# EAGLE schematic DSPBoard (EAGLE 9.2.2)

## Sheet 1 of 9: Power Supply
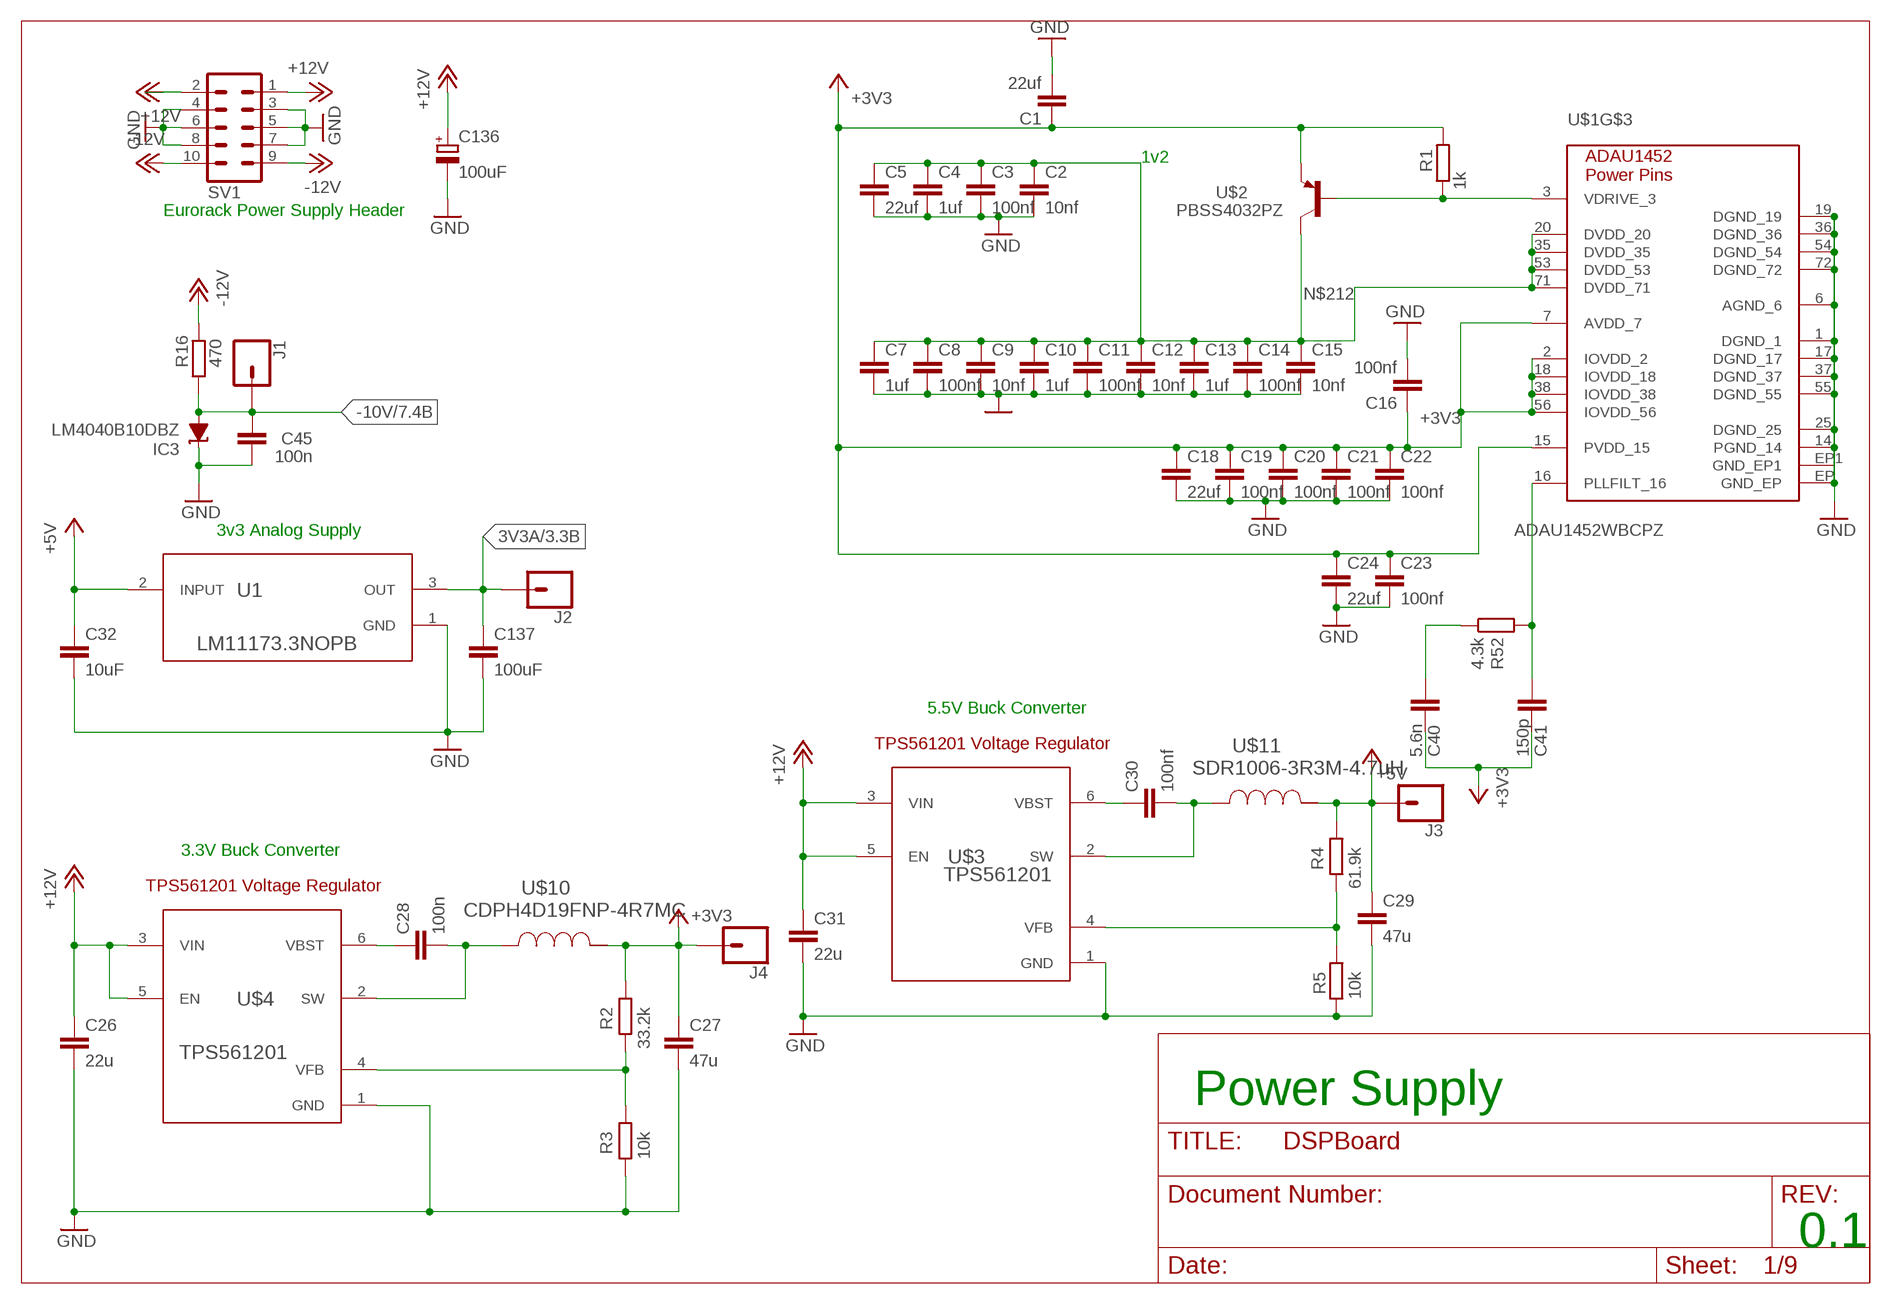
[diagram p0: schematic, sheet 1]

### Parts
C1  22uf  C-EUC0603  [C0603]
C2  10nf  C-EUC0603  [C0603]
C3  100nf  C-EUC0603  [C0603]
C4  1uf  C-EUC0603  [C0603]
C5  22uf  C-EUC0603  [C0603]
C7  1uf  C-EUC0603  [C0603]
C8  100nf  C-EUC0603  [C0603]
C9  10nf  C-EUC0603  [C0603]
C10  1uf  C-EUC0603  [C0603]
C11  100nf  C-EUC0603  [C0603]
C12  10nf  C-EUC0603  [C0603]
C13  1uf  C-EUC0603  [C0603]
C14  100nf  C-EUC0603  [C0603]
C15  10nf  C-EUC0603  [C0603]
C16  100nf  C-EUC0603  [C0603]
C18  22uf  C-EUC0603  [C0603]
C19  100nf  C-EUC0603  [C0603]
C20  100nf  C-EUC0603  [C0603]
C21  100nf  C-EUC0603  [C0603]
C22  100nf  C-EUC0603  [C0603]
C23  100nf  C-EUC0603  [C0603]
C24  22uf  C-EUC0603  [C0603]
C26  22u  C-EUC0603  [C0603]
C27  47u  C-EUC0603  [C0603]
C28  100n  C-EUC0603  [C0603]
C29  47u  C-EUC0603  [C0603]
C30  100nf  C-EUC0603  [C0603]
C31  22u  C-EUC0603  [C0603]
C32  10uF  C-EUC0603  [C0603]
C40  5.6n  C-EUC0603  [C0603]
C41  150p  C-EUC0603  [C0603]
C45  100n  C-EUC0603  [C0603]
C136  100uF  CPOL-EUD  [PANASONIC_D]
C137  100uF  C-EUC0603  [C0603]
IC3  LM4040B10DBZ  LM4041B12DBZ  [DBZ_R-PDSO-G3]
J1  CONN_01  [1X01]
J2  CONN_01  [1X01]
J3  CONN_01  [1X01]
J4  CONN_01  [1X01]
R1  1k  R-EU_R0603  [R0603]
R2  33.2k  R-EU_R0603  [R0603]
R3  10k  R-EU_R0603  [R0603]
R4  61.9k  R-EU_R0603  [R0603]
R5  10k  R-EU_R0603  [R0603]
R16  470  R-EU_R0603  [R0603]
R52  4.3k  R-EU_R0603  [R0603]
SV1  MA05-2  [MA05-2]
U1  LM11173.3NOPB  LM1117DTX-3.3/NOPB  [NDP0003B]
U$1  ADAU1452WBCPZ  [72-LEADLFCSP_VQ]
U$2  PBSS4032PZ  [PG-SOT-223]
U$3  TPS561201  [DDC0006A]
U$4  TPS561201  [DDC0006A]
U$10  CDPH4D19FNP-4R7MC  [CDPH4D19F]
U$11  SDR1006-3R3M-4.7uH  SDR1006-3R3ML  [SDR1006]

### Nets
3V3A: C137.1 J2.1 U1.3(OUT) ; also sheet 3,4
+3V3: C1.1 C16.1 C18.1 C19.1 C20.1 C21.1 C22.1 C23.1 C24.1 C27.1 C40.2 C41.2 J4.1 R1.2 R2.1 U$1.2(IOVDD_2) U$1.7(AVDD_7) U$1.15(PVDD_15) U$1.18(IOVDD_18) U$1.38(IOVDD_38) U$1.56(IOVDD_56) U$2.3(EMITTER_3) U$10.2 ; also sheet 2,3,8,9
+5V: C29.1 C32.1 J3.1 R4.1 U1.2(INPUT) U$11.2 ; also sheet 8,9
+12V: C26.1 C31.1 C136.+ SV1.1 SV1.2 U$3.3(VIN) U$3.5(EN) U$4.3(VIN) U$4.5(EN) ; also sheet 4,5,6,7
-10V: C45.2 IC3.2(A) J1.1 R16.1 ; also sheet 7
-12V: R16.2 SV1.9 SV1.10 ; also sheet 4,5,6,7
GND: C1.2 C2.2 C3.2 C4.2 C5.2 C7.2 C8.2 C9.2 C10.2 C11.2 C12.2 C13.2 C14.2 C15.2 C16.2 C18.2 C19.2 C20.2 C21.2 C22.2 C23.2 C24.2 C26.2 C27.2 C29.2 C31.2 C32.2 C45.1 C136.- C137.2 IC3.1(C) R3.2 R5.2 SV1.3 SV1.4 SV1.5 SV1.6 SV1.7 SV1.8 U1.1(GND) U$1.1(DGND_1) U$1.6(AGND_6) U$1.14(PGND_14) U$1.17(DGND_17) U$1.19(DGND_19) U$1.25(DGND_25) U$1.36(DGND_36) U$1.37(DGND_37) U$1.54(DGND_54) U$1.55(DGND_55) U$1.72(DGND_72) U$1.EP1(GND_EP1) U$1.EP(GND_EP) U$3.1(GND) U$4.1(GND) ; also sheet 2,3,4,5,6,7,8,9
N$1: R1.1 U$1.3(VDRIVE_3) U$2.1(BASE_1)
N$2: C30.1 U$3.6(VBST)
N$3: C28.1 U$4.6(VBST)
N$4: C28.2 U$4.2(SW) U$10.1
N$5: C30.2 U$3.2(SW) U$11.1
N$6: R2.2 R3.1 U$4.4(VFB)
N$8: R4.2 R5.1 U$3.4(VFB)
N$21: C41.1 R52.2 U$1.16(PLLFILT_16)
N$24: C40.1 R52.1
N$212: C2.1 C3.1 C4.1 C5.1 C7.1 C8.1 C9.1 C10.1 C11.1 C12.1 C13.1 C14.1 C15.1 U$1.20(DVDD_20) U$1.35(DVDD_35) U$1.53(DVDD_53) U$1.71(DVDD_71) U$2.2(COLLECTOR_2,4) U$2.4(COLLECTOR_2,4)

### Notes on the sheet
- 1v2
- Eurorack Power Supply Header
- 3v3 Analog Supply
- 5.5V Buck Converter
- 3.3V Buck Converter
- Power Supply
- 0.1

## Sheet 2 of 9: Controller, I2C & GPIO
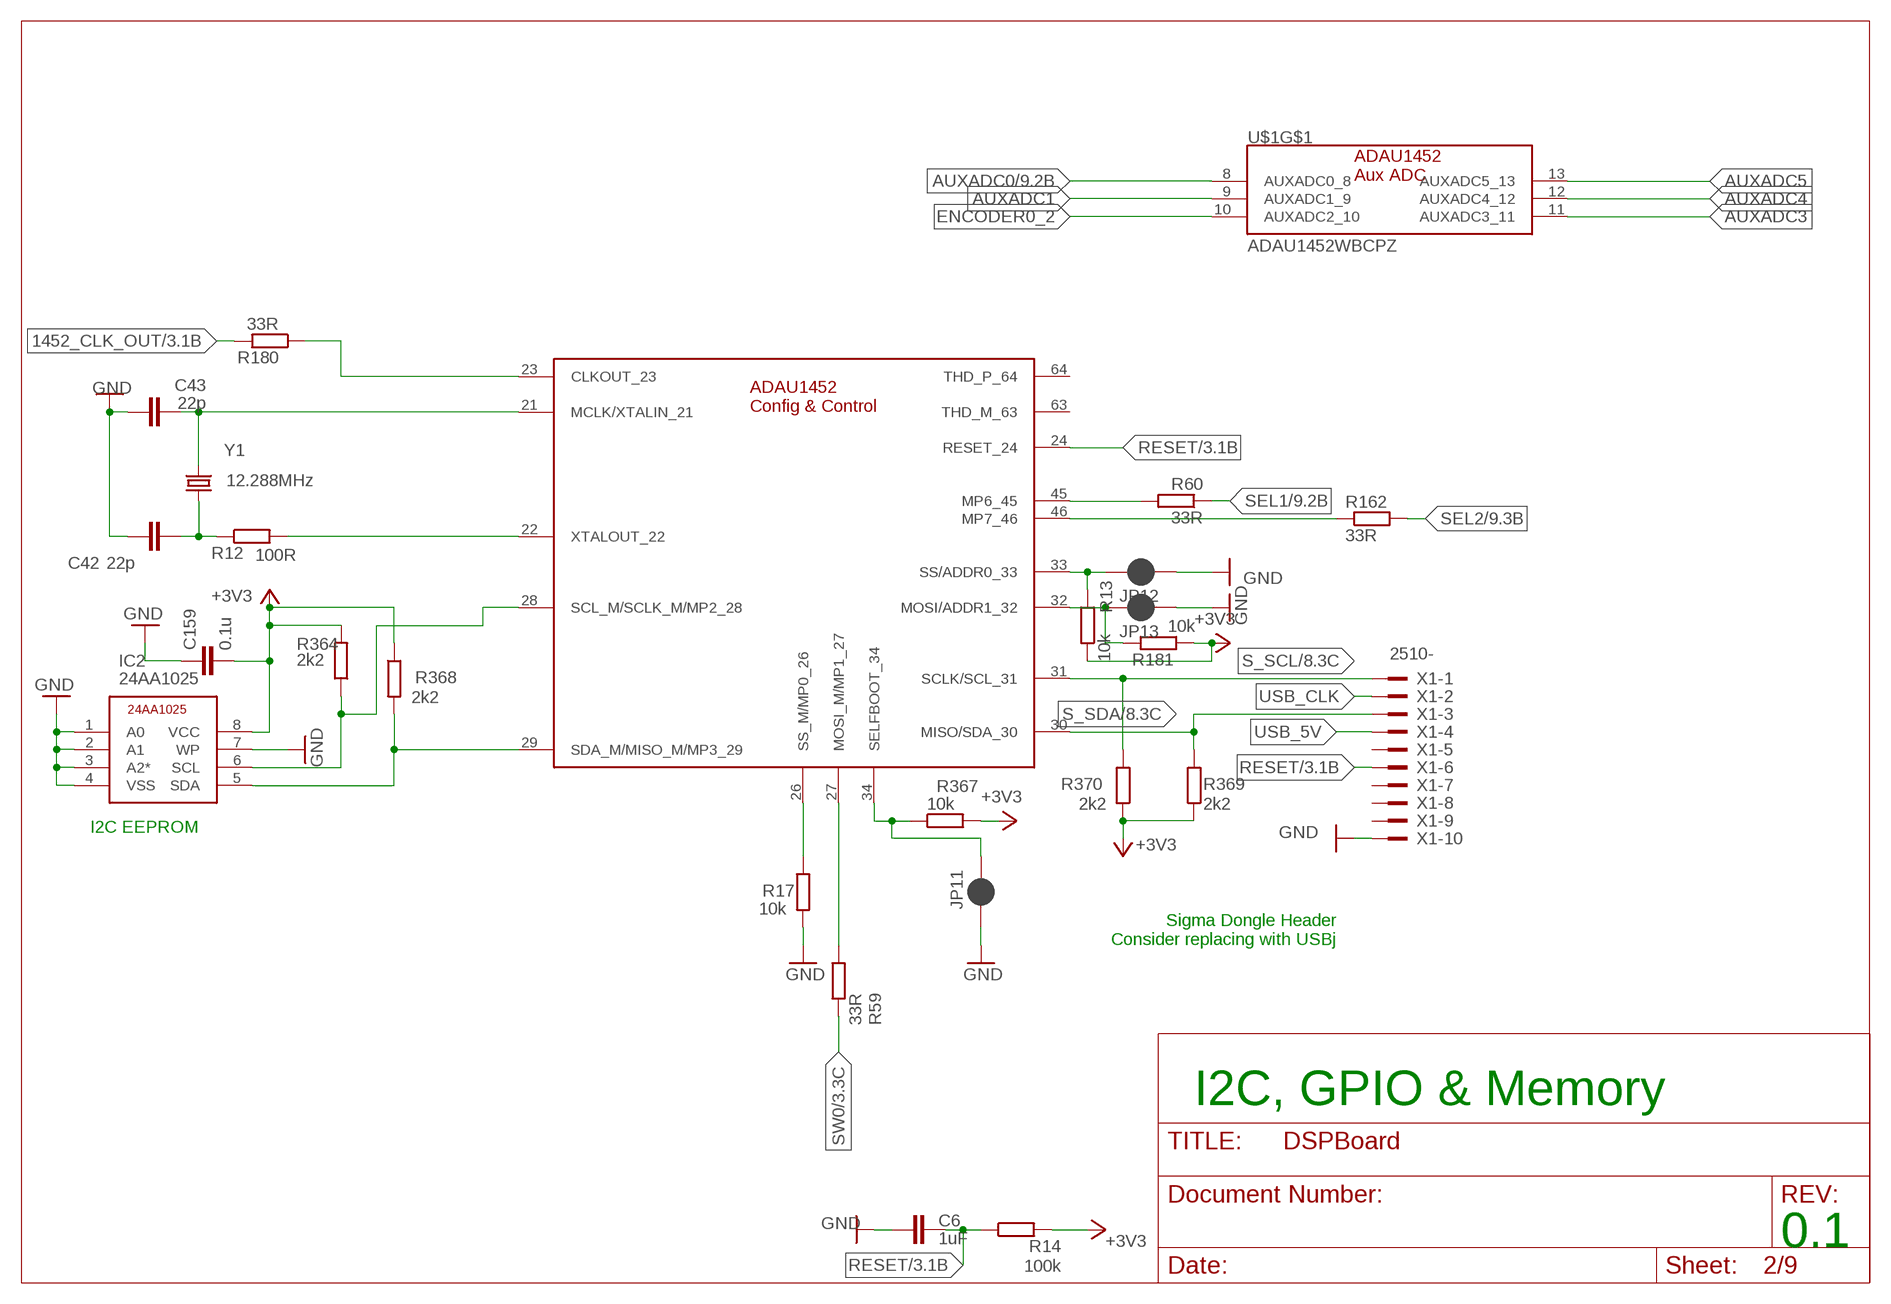
[diagram p1: schematic, sheet 2]

### Parts
C6  1uF  C-EUC0603  [C0603]
C42  22p  C-EUC0603  [C0603]
C43  22p  C-EUC0603  [C0603]
C159  0.1u  C-EUC0603  [C0603]
IC2  24AA1025  [SOIC8]
JP11  JUMPER-SMT_2_NC_PASTE_SILK  [SMT-JUMPER_2_NC_PASTE_SILK]
JP12  JUMPER-SMT_2_NC_PASTE_SILK  [SMT-JUMPER_2_NC_PASTE_SILK]
JP13  JUMPER-SMT_2_NC_PASTE_SILK  [SMT-JUMPER_2_NC_PASTE_SILK]
R12  100R  R-EU_R0603  [R0603]
R13  10k  R-EU_R0603  [R0603]
R14  100k  R-EU_R0603  [R0603]
R17  10k  R-EU_R0603  [R0603]
R59  33R  R-EU_R0603  [R0603]
R60  33R  R-EU_R0603  [R0603]
R162  33R  R-EU_R0603  [R0603]
R180  33R  R-EU_R0603  [R0603]
R181  10k  R-EU_R0603  [R0603]
R364  2k2  R-EU_R0603  [R0603]
R367  10k  R-EU_R0603  [R0603]
R368  2k2  R-EU_R0603  [R0603]
R369  2k2  R-EU_R0603  [R0603]
R370  2k2  R-EU_R0603  [R0603]
X1  2510-  [PAK100/2500-10]
Y1  12.288MHz  CRYSTAL-12.288MHZ"  [CRYSTAL-SMD-5X3.2-4PAD]

### Nets
1452_CLK_OUT: R180.2 ; also sheet 3
+3V3: C159.2 IC2.8(VCC) R13.1 R14.2 R181.1 R364.2 R367.2 R368.1 R369.1 R370.1 ; also sheet 1,3,8,9
AUXADC0: U$1.8(AUXADC0_8) ; also sheet 9
AUXADC1: U$1.9(AUXADC1_9)
AUXADC3: U$1.11(AUXADC3_11)
AUXADC4: U$1.12(AUXADC4_12)
AUXADC5: U$1.13(AUXADC5_13)
ENCODER0_2: U$1.10(AUXADC2_10)
GND: C6.2 C42.1 C43.1 C159.1 IC2.1(A0) IC2.2(A1) IC2.3(A2*) IC2.4(VSS) IC2.7(WP) JP11.1 JP12.1 JP13.1 R17.2 X1.10 ; also sheet 1,3,4,5,6,7,8,9
MP0: R17.1 U$1.26(SS_M/MP0_26)
MP1: R59.1 U$1.27(MOSI_M/MP1_27)
MP2: IC2.6(SCL) R364.1 U$1.28(SCL_M/SCLK_M/MP2_28)
MP3: IC2.5(SDA) R368.2 U$1.29(SDA_M/MISO_M/MP3_29)
MP6: R60.2 U$1.45(MP6_45)
MP7: R162.1 U$1.46(MP7_46)
N$27: R12.2 U$1.22(XTALOUT_22)
N$28: C43.2 U$1.21(MCLK/XTALIN_21) Y1.3
N$29: C42.2 R12.1 Y1.1
N$141: R180.1 U$1.23(CLKOUT_23)
N$142: JP12.2 R13.2 U$1.33(SS/ADDR0_33)
N$157: JP13.2 R181.2 U$1.32(MOSI/ADDR1_32)
N$545: JP11.2 R367.1 U$1.34(SELFBOOT_34)
RESET: C6.1 R14.1 U$1.24(RESET_24) X1.6 ; also sheet 3,8
S_SCL: R370.2 U$1.31(SCLK/SCL_31) X1.1 ; also sheet 8
S_SDA: R369.2 U$1.30(MISO/SDA_30) X1.3 ; also sheet 8
SEL1: R60.1 ; also sheet 9
SEL2: R162.2 ; also sheet 9
SW0: R59.2 ; also sheet 3,9
USB_5V: X1.4
USB_CLK: X1.2
Unconnected: U$1.63(THD_M_63) U$1.64(THD_P_64) X1.5 X1.7 X1.8 X1.9

### Notes on the sheet
- I2C EEPROM
- Sigma Dongle Header
  Consider replacing with USBj
- I2C, GPIO & Memory
- 0.1

## Sheet 3 of 9: Digital Audio Connections
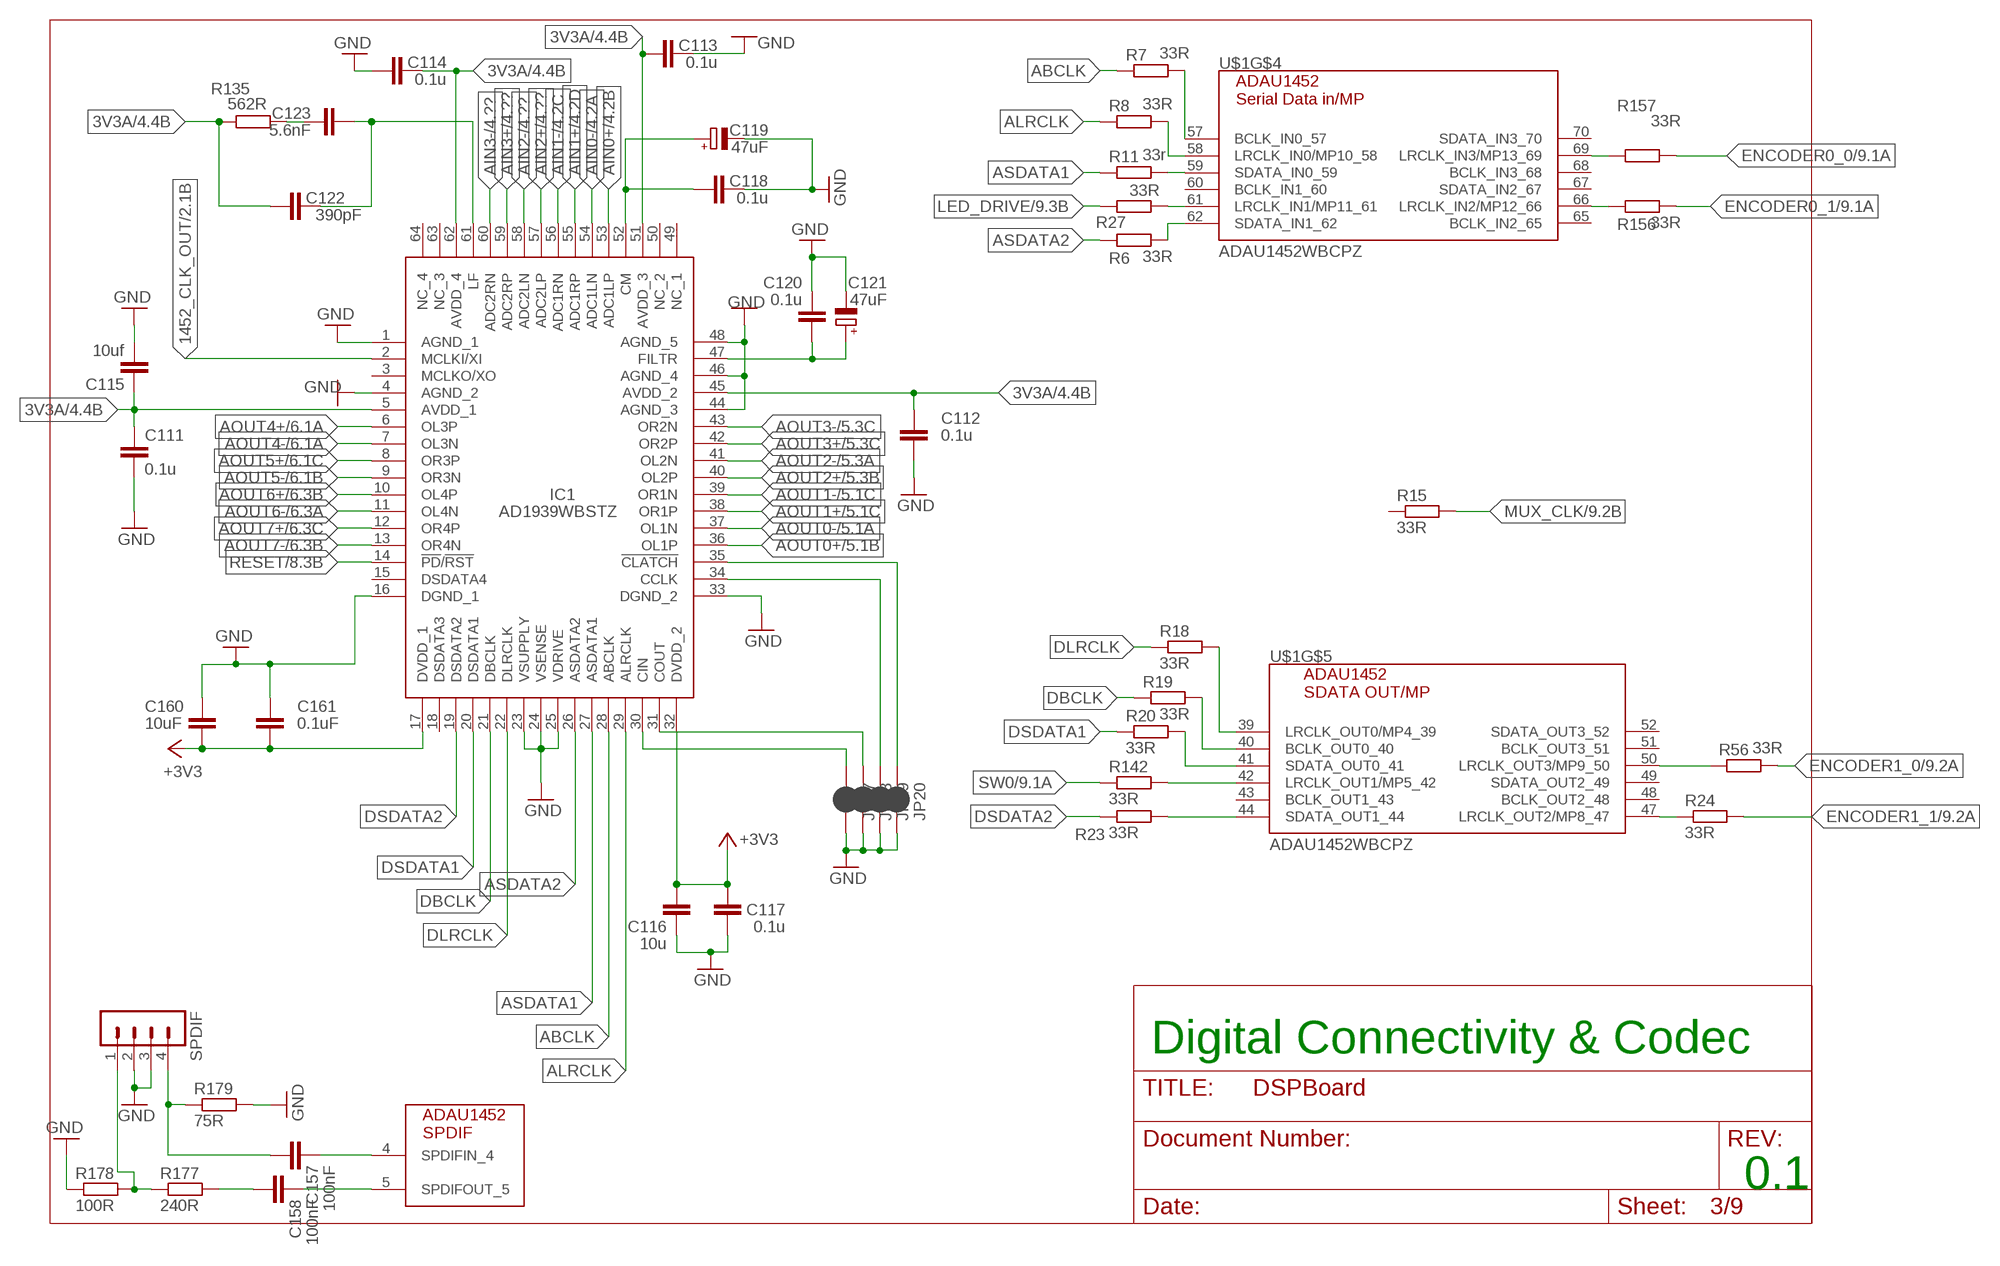
[diagram p2: schematic, sheet 3]

### Parts
C111  0.1u  C-EUC0603  [C0603]
C112  0.1u  C-EUC0603  [C0603]
C113  0.1u  C-EUC0603  [C0603]
C114  0.1u  C-EUC0603  [C0603]
C115  10uf  C-EUC0603  [C0603]
C116  10u  C-EUC0603  [C0603]
C117  0.1u  C-EUC0603  [C0603]
C118  0.1u  C-EUC0603  [C0603]
C119  47uF  CPOL-EUD  [PANASONIC_D]
C120  0.1u  C-EUC0603  [C0603]
C121  47uF  CPOL-EUD  [PANASONIC_D]
C122  390pF  C-EUC0603  [C0603]
C123  5.6nF  C-EUC0603  [C0603]
C157  100nF  C-EUC0603  [C0603]
C158  100nF  C-EUC0603  [C0603]
C160  10uF  C-EUC0603  [C0603]
C161  0.1uF  C-EUC0603  [C0603]
IC1  AD1939WBSTZ  [QFP50P1200X1200X160-64N]
JP17  JUMPER-SMT_2_NC_PASTE_SILK  [SMT-JUMPER_2_NC_PASTE_SILK]
JP18  JUMPER-SMT_2_NC_PASTE_SILK  [SMT-JUMPER_2_NC_PASTE_SILK]
JP19  JUMPER-SMT_2_NC_PASTE_SILK  [SMT-JUMPER_2_NC_PASTE_SILK]
JP20  JUMPER-SMT_2_NC_PASTE_SILK  [SMT-JUMPER_2_NC_PASTE_SILK]
R6  33R  R-EU_R0603  [R0603]
R7  33R  R-EU_R0603  [R0603]
R8  33R  R-EU_R0603  [R0603]
R11  33r  R-EU_R0603  [R0603]
R15  33R  R-EU_R0603  [R0603]
R18  33R  R-EU_R0603  [R0603]
R19  33R  R-EU_R0603  [R0603]
R20  33R  R-EU_R0603  [R0603]
R23  33R  R-EU_R0603  [R0603]
R24  33R  R-EU_R0603  [R0603]
R27  33R  R-EU_R0603  [R0603]
R56  33R  R-EU_R0603  [R0603]
R135  562R  R-EU_R0603  [R0603]
R142  33R  R-EU_R0603  [R0603]
R156  33R  R-EU_R0603  [R0603]
R157  33R  R-EU_R0603  [R0603]
R177  240R  R-EU_R0603  [R0603]
R178  100R  R-EU_R0603  [R0603]
R179  75R  R-EU_R0603  [R0603]
SPDIF  MA04-1  [MA04-1]

### Nets
3V3A: C111.1 C112.1 C113.1 C114.2 C115.1 C122.1 IC1.5(AVDD_1) IC1.45(AVDD_2) IC1.51(AVDD_3) IC1.62(AVDD_4) R135.1 ; also sheet 1,4
1452_CLK_OUT: IC1.2(MCLKI/XI) ; also sheet 2
+3V3: C116.2 C117.2 C160.2 C161.2 IC1.17(DVDD_1) IC1.32(DVDD_2) ; also sheet 1,2,8,9
ABCLK: IC1.28(ABCLK) R7.1
AIN0+: IC1.53(ADC1LP) ; also sheet 4
AIN0-: IC1.54(ADC1LN) ; also sheet 4
AIN1+: IC1.55(ADC1RP) ; also sheet 4
AIN1-: IC1.56(ADC1RN) ; also sheet 4
AIN2+: IC1.57(ADC2LP) ; also sheet 4
AIN2-: IC1.58(ADC2LN) ; also sheet 4
AIN3+: IC1.59(ADC2RP) ; also sheet 4
AIN3-: IC1.60(ADC2RN) ; also sheet 4
ALRCLK: IC1.29(ALRCLK) R8.1
AOUT0+: IC1.36(OL1P) ; also sheet 5
AOUT0-: IC1.37(OL1N) ; also sheet 5
AOUT1+: IC1.38(OR1P) ; also sheet 5
AOUT1-: IC1.39(OR1N) ; also sheet 5
AOUT2+: IC1.40(OL2P) ; also sheet 5
AOUT2-: IC1.41(OL2N) ; also sheet 5
AOUT3+: IC1.42(OR2P) ; also sheet 5
AOUT3-: IC1.43(OR2N) ; also sheet 5
AOUT4+: IC1.6(OL3P) ; also sheet 6
AOUT4-: IC1.7(OL3N) ; also sheet 6
AOUT5+: IC1.8(OR3P) ; also sheet 6
AOUT5-: IC1.9(OR3N) ; also sheet 6
AOUT6+: IC1.10(OL4P) ; also sheet 6
AOUT6-: IC1.11(OL4N) ; also sheet 6
AOUT7+: IC1.12(OR4P) ; also sheet 6
AOUT7-: IC1.13(OR4N) ; also sheet 6
ASDATA1: IC1.27(ASDATA1) R11.1
ASDATA2: IC1.26(ASDATA2) R6.1
DBCLK: IC1.21(DBCLK) R19.1
DLRCLK: IC1.22(DLRCLK) R18.1
DSDATA1: IC1.20(DSDATA1) R20.1
DSDATA2: IC1.19(DSDATA2) R23.1
DSP_47: R24.1 U$1.47(LRCLK_OUT2/MP8_47)
DSP_50: R56.1 U$1.50(LRCLK_OUT3/MP9_50)
ENCODER0_0: R157.2 ; also sheet 9
ENCODER0_1: R156.2 ; also sheet 9
ENCODER1_0: R56.2 ; also sheet 9
ENCODER1_1: R24.2 ; also sheet 9
FILTR: C120.1 C121.+ IC1.47(FILTR)
GND: C111.2 C112.2 C113.2 C114.1 C115.2 C116.1 C117.1 C118.2 C119.- C120.2 C121.- C160.1 C161.1 IC1.1(AGND_1) IC1.4(AGND_2) IC1.16(DGND_1) IC1.23(VSUPPLY) IC1.24(VSENSE) IC1.25(VDRIVE) IC1.33(DGND_2) IC1.44(AGND_3) IC1.46(AGND_4) IC1.48(AGND_5) JP17.2 JP18.2 JP19.2 JP20.2 R178.1 R179.2 SPDIF.2 SPDIF.3 ; also sheet 1,2,4,5,6,7,8,9
LED_DRIVE: R27.2 ; also sheet 9
MP4: R18.2 U$1.39(LRCLK_OUT0/MP4_39)
MP5: R142.2 U$1.42(LRCLK_OUT1/MP5_42)
MP10: R8.2 U$1.58(LRCLK_IN0/MP10_58)
MP11: R27.1 U$1.61(LRCLK_IN1/MP11_61)
MUX_CLK: R15.2 ; also sheet 9
N$7: IC1.30(CIN) JP17.1
N$19: R156.1 U$1.66(LRCLK_IN2/MP12_66)
N$20: R157.1 U$1.69(LRCLK_IN3/MP13_69)
N$23: JP20.1
N$25: JP19.1
N$31: C157.1 U$1.4(SPDIFIN_4)
N$32: C158.1 U$1.5(SPDIFOUT_5)
N$35: R6.2 U$1.62(SDATA_IN1_62)
N$37: C157.2 R179.1 SPDIF.4
N$75: C118.1 C119.+ IC1.52(CM)
N$76: R7.2 U$1.57(BCLK_IN0_57)
N$117: C123.1 R135.2
N$119: C122.2 C123.2 IC1.61(LF)
N$120: R11.2 U$1.59(SDATA_IN0_59)
N$124: R23.2 U$1.44(SDATA_OUT1_44)
N$127: R20.2 U$1.41(SDATA_OUT0_41)
N$128: R19.2 U$1.40(BCLK_OUT0_40)
N$129: C158.2 R177.2
N$135: IC1.35(!CLATCH)
N$138: R177.1 R178.2 SPDIF.1
N$158: IC1.34(CCLK)
N$159: IC1.31(COUT) JP18.1
RESET: IC1.14(!PD!/!RST) ; also sheet 2,8
SW0: R142.1 ; also sheet 2,9
Unconnected: IC1.3(MCLKO/XO) IC1.15(DSDATA4) IC1.18(DSDATA3) IC1.49(NC_1) IC1.50(NC_2) IC1.63(NC_3) IC1.64(NC_4) R15.1 U$1.43(BCLK_OUT1_43) U$1.48(BCLK_OUT2_48) U$1.49(SDATA_OUT2_49) U$1.51(BCLK_OUT3_51) U$1.52(SDATA_OUT3_52) U$1.60(BCLK_IN1_60) U$1.65(BCLK_IN2_65) U$1.67(SDATA_IN2_67) U$1.68(BCLK_IN3_68) U$1.70(SDATA_IN3_70)

### Notes on the sheet
- Digital Connectivity & Codec
- 0.1

## Sheet 4 of 9: Audio In
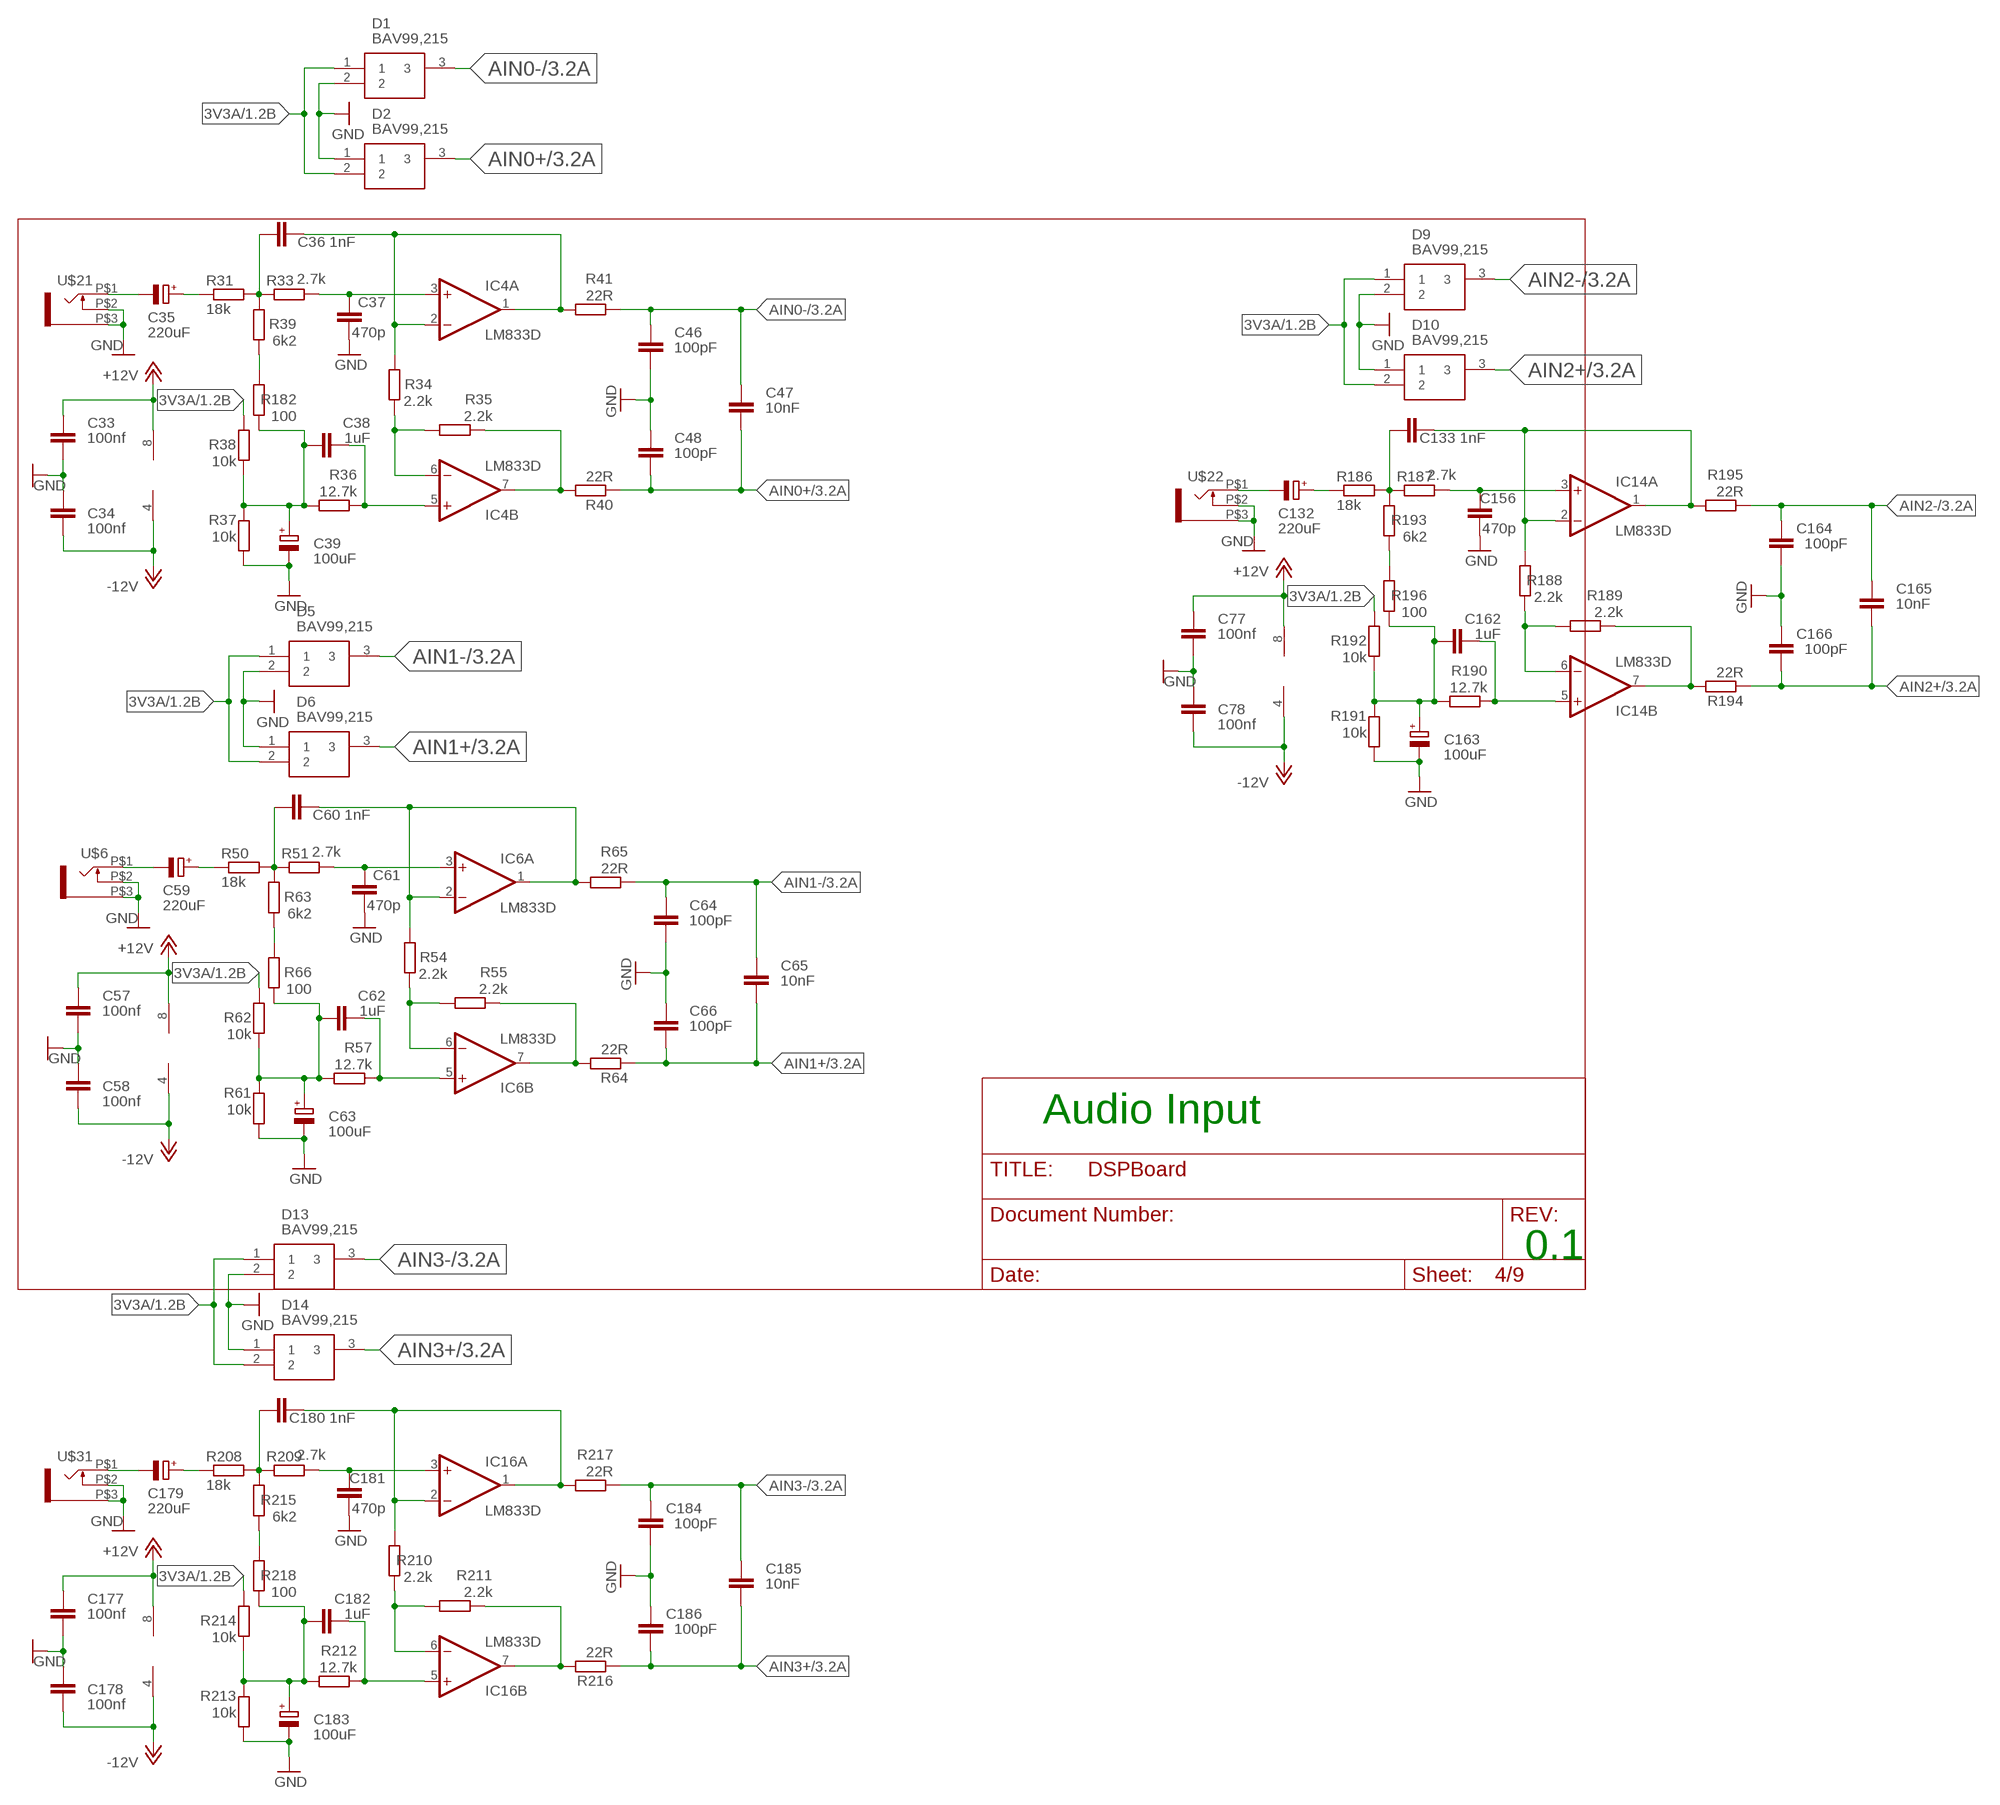
[diagram p3: schematic, sheet 4]

### Parts
C33  100nf  C-EUC0603  [C0603]
C34  100nf  C-EUC0603  [C0603]
C35  220uF  CPOL-EUD  [PANASONIC_D]
C36  1nF  C-EUC0603  [C0603]
C37  470p  C-EUC0603  [C0603]
C38  1uF  C-EUC0603  [C0603]
C39  100uF  CPOL-EUD  [PANASONIC_D]
C46  100pF  C-EUC0603  [C0603]
C47  10nF  C-EUC0603  [C0603]
C48  100pF  C-EUC0603  [C0603]
C57  100nf  C-EUC0603  [C0603]
C58  100nf  C-EUC0603  [C0603]
C59  220uF  CPOL-EUD  [PANASONIC_D]
C60  1nF  C-EUC0603  [C0603]
C61  470p  C-EUC0603  [C0603]
C62  1uF  C-EUC0603  [C0603]
C63  100uF  CPOL-EUD  [PANASONIC_D]
C64  100pF  C-EUC0603  [C0603]
C65  10nF  C-EUC0603  [C0603]
C66  100pF  C-EUC0603  [C0603]
C77  100nf  C-EUC0603  [C0603]
C78  100nf  C-EUC0603  [C0603]
C132  220uF  CPOL-EUD  [PANASONIC_D]
C133  1nF  C-EUC0603  [C0603]
C156  470p  C-EUC0603  [C0603]
C162  1uF  C-EUC0603  [C0603]
C163  100uF  CPOL-EUD  [PANASONIC_D]
C164  100pF  C-EUC0603  [C0603]
C165  10nF  C-EUC0603  [C0603]
C166  100pF  C-EUC0603  [C0603]
C177  100nf  C-EUC0603  [C0603]
C178  100nf  C-EUC0603  [C0603]
C179  220uF  CPOL-EUD  [PANASONIC_D]
C180  1nF  C-EUC0603  [C0603]
C181  470p  C-EUC0603  [C0603]
C182  1uF  C-EUC0603  [C0603]
C183  100uF  CPOL-EUD  [PANASONIC_D]
C184  100pF  C-EUC0603  [C0603]
C185  10nF  C-EUC0603  [C0603]
C186  100pF  C-EUC0603  [C0603]
D1  BAV99,215  [SOT95P230X110-3N]
D2  BAV99,215  [SOT95P230X110-3N]
D5  BAV99,215  [SOT95P230X110-3N]
D6  BAV99,215  [SOT95P230X110-3N]
D9  BAV99,215  [SOT95P230X110-3N]
D10  BAV99,215  [SOT95P230X110-3N]
D13  BAV99,215  [SOT95P230X110-3N]
D14  BAV99,215  [SOT95P230X110-3N]
IC4  LM833D  [SO08]
IC6  LM833D  [SO08]
IC14  LM833D  [SO08]
IC16  LM833D  [SO08]
R31  18k  R-EU_R0603  [R0603]
R33  2.7k  R-EU_R0603  [R0603]
R34  2.2k  R-EU_R0603  [R0603]
R35  2.2k  R-EU_R0603  [R0603]
R36  12.7k  R-EU_R0603  [R0603]
R37  10k  R-EU_R0603  [R0603]
R38  10k  R-EU_R0603  [R0603]
R39  6k2  R-EU_R0603  [R0603]
R40  22R  R-EU_R0603  [R0603]
R41  22R  R-EU_R0603  [R0603]
R50  18k  R-EU_R0603  [R0603]
R51  2.7k  R-EU_R0603  [R0603]
R54  2.2k  R-EU_R0603  [R0603]
R55  2.2k  R-EU_R0603  [R0603]
R57  12.7k  R-EU_R0603  [R0603]
R61  10k  R-EU_R0603  [R0603]
R62  10k  R-EU_R0603  [R0603]
R63  6k2  R-EU_R0603  [R0603]
R64  22R  R-EU_R0603  [R0603]
R65  22R  R-EU_R0603  [R0603]
R66  100  R-EU_R0603  [R0603]
R182  100  R-EU_R0603  [R0603]
R186  18k  R-EU_R0603  [R0603]
R187  2.7k  R-EU_R0603  [R0603]
R188  2.2k  R-EU_R0603  [R0603]
R189  2.2k  R-EU_R0603  [R0603]
R190  12.7k  R-EU_R0603  [R0603]
R191  10k  R-EU_R0603  [R0603]
R192  10k  R-EU_R0603  [R0603]
R193  6k2  R-EU_R0603  [R0603]
R194  22R  R-EU_R0603  [R0603]
R195  22R  R-EU_R0603  [R0603]
R196  100  R-EU_R0603  [R0603]
R208  18k  R-EU_R0603  [R0603]
R209  2.7k  R-EU_R0603  [R0603]
R210  2.2k  R-EU_R0603  [R0603]
R211  2.2k  R-EU_R0603  [R0603]
R212  12.7k  R-EU_R0603  [R0603]
R213  10k  R-EU_R0603  [R0603]
R214  10k  R-EU_R0603  [R0603]
R215  6k2  R-EU_R0603  [R0603]
R216  22R  R-EU_R0603  [R0603]
R217  22R  R-EU_R0603  [R0603]
R218  100  R-EU_R0603  [R0603]
U$6  WQP-PJ301M-12_JACK  [WQP-PJ301M-12_JACK]
U$21  WQP-PJ301M-12_JACK  [WQP-PJ301M-12_JACK]
U$22  WQP-PJ301M-12_JACK  [WQP-PJ301M-12_JACK]
U$31  WQP-PJ301M-12_JACK  [WQP-PJ301M-12_JACK]

### Nets
3V3A: D1.1 D2.2 D5.1 D6.2 D9.1 D10.2 D13.1 D14.2 R38.2 R62.2 R192.2 R214.2 ; also sheet 1,3
+12V: C33.1 C57.1 C77.1 C177.1 IC4.8(P:V+) IC6.8(P:V+) IC14.8(P:V+) IC16.8(P:V+) ; also sheet 1,5,6,7
-12V: C34.2 C58.2 C78.2 C178.2 IC4.4(P:V-) IC6.4(P:V-) IC14.4(P:V-) IC16.4(P:V-) ; also sheet 1,5,6,7
AIN0+: C47.2 C48.1 D2.3 R40.1 ; also sheet 3
AIN0-: C46.2 C47.1 D1.3 R41.1 ; also sheet 3
AIN1+: C65.2 C66.1 D6.3 R64.1 ; also sheet 3
AIN1-: C64.2 C65.1 D5.3 R65.1 ; also sheet 3
AIN2+: C165.2 C166.1 D10.3 R194.1 ; also sheet 3
AIN2-: C164.2 C165.1 D9.3 R195.1 ; also sheet 3
AIN3+: C185.2 C186.1 D14.3 R216.1 ; also sheet 3
AIN3-: C184.2 C185.1 D13.3 R217.1 ; also sheet 3
GND: C33.2 C34.1 C37.1 C39.- C46.1 C48.2 C57.2 C58.1 C61.1 C63.- C64.1 C66.2 C77.2 C78.1 C156.1 C163.- C164.1 C166.2 C177.2 C178.1 C181.1 C183.- C184.1 C186.2 D1.2 D2.1 D5.2 D6.1 D9.2 D10.1 D13.2 D14.1 R37.1 R61.1 R191.1 R213.1 U$6.P$2 U$6.P$3 U$21.P$2 U$21.P$3 U$22.P$2 U$22.P$3 U$31.P$2 U$31.P$3 ; also sheet 1,2,3,5,6,7,8,9
N$9: C35.- U$21.P$1
N$10: C35.+ R31.1
N$11: C36.1 R31.2 R33.1 R39.2
N$12: C37.2 IC4.3(A:+IN) R33.2
N$13: IC4.6(B:-IN) R34.1 R35.2
N$14: C36.2 IC4.1(A:OUT) IC4.2(A:-IN) R34.2 R41.2
N$15: IC4.7(B:OUT) R35.1 R40.2
N$16: C38.2 IC4.5(B:+IN) R36.1
N$18: C38.1 C39.+ R36.2 R37.2 R38.1 R182.1
N$42: C60.1 R50.2 R51.1 R63.2
N$43: C61.2 IC6.3(A:+IN) R51.2
N$44: C60.2 IC6.1(A:OUT) IC6.2(A:-IN) R54.2 R65.2
N$45: IC6.6(B:-IN) R54.1 R55.2
N$46: IC6.7(B:OUT) R55.1 R64.2
N$47: C62.2 IC6.5(B:+IN) R57.1
N$48: C62.1 C63.+ R57.2 R61.2 R62.1 R66.1
N$49: C59.- U$6.P$1
N$50: C59.+ R50.1
N$51: R63.1 R66.2
N$160: R39.1 R182.2
N$168: C133.1 R186.2 R187.1 R193.2
N$169: C156.2 IC14.3(A:+IN) R187.2
N$170: C133.2 IC14.1(A:OUT) IC14.2(A:-IN) R188.2 R195.2
N$171: IC14.6(B:-IN) R188.1 R189.2
N$172: IC14.7(B:OUT) R189.1 R194.2
N$173: C162.2 IC14.5(B:+IN) R190.1
N$174: C162.1 C163.+ R190.2 R191.2 R192.1 R196.1
N$175: C132.- U$22.P$1
N$176: C132.+ R186.1
N$177: R193.1 R196.2
N$188: C180.1 R208.2 R209.1 R215.2
N$189: C181.2 IC16.3(A:+IN) R209.2
N$190: C180.2 IC16.1(A:OUT) IC16.2(A:-IN) R210.2 R217.2
N$191: IC16.6(B:-IN) R210.1 R211.2
N$192: IC16.7(B:OUT) R211.1 R216.2
N$193: C182.2 IC16.5(B:+IN) R212.1
N$194: C182.1 C183.+ R212.2 R213.2 R214.1 R218.1
N$195: C179.- U$31.P$1
N$196: C179.+ R208.1
N$197: R215.1 R218.2

### Notes on the sheet
- Audio Input
- 0.1

## Sheet 5 of 9: Audio Out 1
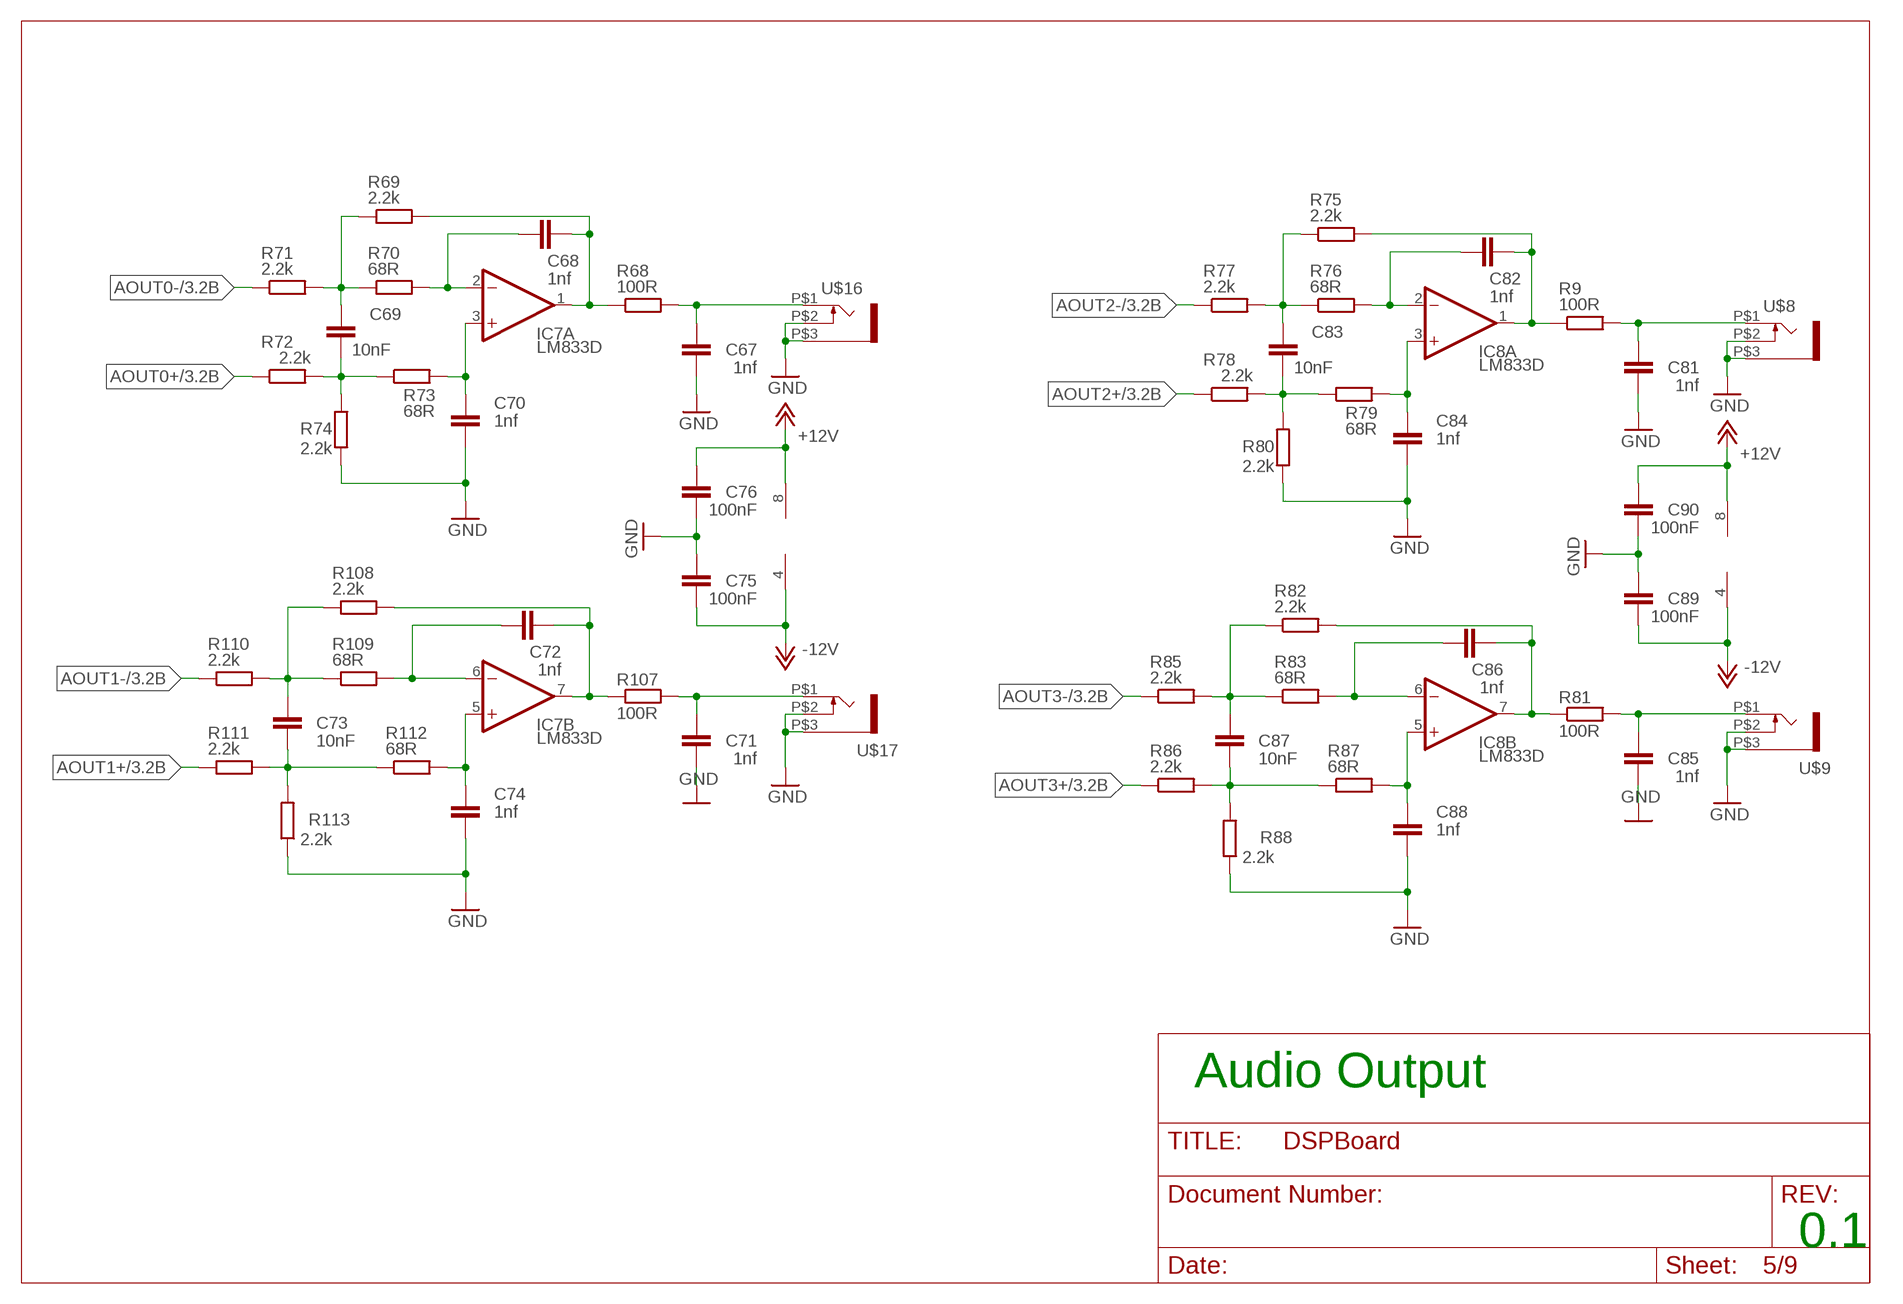
[diagram p4: schematic, sheet 5]

### Parts
C67  1nf  C-EUC0603  [C0603]
C68  1nf  C-EUC0603  [C0603]
C69  10nF  C-EUC0603  [C0603]
C70  1nf  C-EUC0603  [C0603]
C71  1nf  C-EUC0603  [C0603]
C72  1nf  C-EUC0603  [C0603]
C73  10nF  C-EUC0603  [C0603]
C74  1nf  C-EUC0603  [C0603]
C75  100nF  C-EUC0603  [C0603]
C76  100nF  C-EUC0603  [C0603]
C81  1nf  C-EUC0603  [C0603]
C82  1nf  C-EUC0603  [C0603]
C83  10nF  C-EUC0603  [C0603]
C84  1nf  C-EUC0603  [C0603]
C85  1nf  C-EUC0603  [C0603]
C86  1nf  C-EUC0603  [C0603]
C87  10nF  C-EUC0603  [C0603]
C88  1nf  C-EUC0603  [C0603]
C89  100nF  C-EUC0603  [C0603]
C90  100nF  C-EUC0603  [C0603]
IC7  LM833D  [SO08]
IC8  LM833D  [SO08]
R9  100R  R-EU_R0603  [R0603]
R68  100R  R-EU_R0603  [R0603]
R69  2.2k  R-EU_R0603  [R0603]
R70  68R  R-EU_R0603  [R0603]
R71  2.2k  R-EU_R0603  [R0603]
R72  2.2k  R-EU_R0603  [R0603]
R73  68R  R-EU_R0603  [R0603]
R74  2.2k  R-EU_R0603  [R0603]
R75  2.2k  R-EU_R0603  [R0603]
R76  68R  R-EU_R0603  [R0603]
R77  2.2k  R-EU_R0603  [R0603]
R78  2.2k  R-EU_R0603  [R0603]
R79  68R  R-EU_R0603  [R0603]
R80  2.2k  R-EU_R0603  [R0603]
R81  100R  R-EU_R0603  [R0603]
R82  2.2k  R-EU_R0603  [R0603]
R83  68R  R-EU_R0603  [R0603]
R85  2.2k  R-EU_R0603  [R0603]
R86  2.2k  R-EU_R0603  [R0603]
R87  68R  R-EU_R0603  [R0603]
R88  2.2k  R-EU_R0603  [R0603]
R107  100R  R-EU_R0603  [R0603]
R108  2.2k  R-EU_R0603  [R0603]
R109  68R  R-EU_R0603  [R0603]
R110  2.2k  R-EU_R0603  [R0603]
R111  2.2k  R-EU_R0603  [R0603]
R112  68R  R-EU_R0603  [R0603]
R113  2.2k  R-EU_R0603  [R0603]
U$8  WQP-PJ301M-12_JACK  [WQP-PJ301M-12_JACK]
U$9  WQP-PJ301M-12_JACK  [WQP-PJ301M-12_JACK]
U$16  WQP-PJ301M-12_JACK  [WQP-PJ301M-12_JACK]
U$17  WQP-PJ301M-12_JACK  [WQP-PJ301M-12_JACK]

### Nets
+12V: C76.2 C90.2 IC7.8(P:V+) IC8.8(P:V+) ; also sheet 1,4,6,7
-12V: C75.1 C89.1 IC7.4(P:V-) IC8.4(P:V-) ; also sheet 1,4,6,7
AOUT0+: R72.1 ; also sheet 3
AOUT0-: R71.1 ; also sheet 3
AOUT1+: R111.1 ; also sheet 3
AOUT1-: R110.1 ; also sheet 3
AOUT2+: R78.1 ; also sheet 3
AOUT2-: R77.1 ; also sheet 3
AOUT3+: R86.1 ; also sheet 3
AOUT3-: R85.1 ; also sheet 3
GND: C67.1 C70.2 C71.1 C74.2 C75.2 C76.1 C81.1 C84.2 C85.1 C88.2 C89.2 C90.1 R74.1 R80.1 R88.1 R113.1 U$8.P$2 U$8.P$3 U$9.P$2 U$9.P$3 U$16.P$2 U$16.P$3 U$17.P$2 U$17.P$3 ; also sheet 1,2,3,4,6,7,8,9
N$53: C72.2 IC7.6(B:-IN) R109.2
N$54: C73.1 R108.1 R109.1 R110.2
N$55: C73.2 R111.2 R112.1 R113.2
N$56: C72.1 IC7.7(B:OUT) R107.1 R108.2
N$57: C74.1 IC7.5(B:+IN) R112.2
N$58: C71.2 R107.2 U$17.P$1
N$59: C67.2 R68.2 U$16.P$1
N$60: C68.1 IC7.1(A:OUT) R68.1 R69.2
N$61: C68.2 IC7.2(A:-IN) R70.2
N$62: C69.1 R69.1 R70.1 R71.2
N$63: C69.2 R72.2 R73.1 R74.2
N$64: C70.1 IC7.3(A:+IN) R73.2
N$70: C86.2 IC8.6(B:-IN) R83.2
N$71: C87.1 R82.1 R83.1 R85.2
N$72: C87.2 R86.2 R87.1 R88.2
N$73: C86.1 IC8.7(B:OUT) R81.1 R82.2
N$74: C88.1 IC8.5(B:+IN) R87.2
N$77: C85.2 R81.2 U$9.P$1
N$78: C81.2 R9.2 U$8.P$1
N$79: C82.1 IC8.1(A:OUT) R9.1 R75.2
N$80: C82.2 IC8.2(A:-IN) R76.2
N$81: C83.1 R75.1 R76.1 R77.2
N$82: C83.2 R78.2 R79.1 R80.2
N$83: C84.1 IC8.3(A:+IN) R79.2

### Notes on the sheet
- Audio Output
- 0.1

## Sheet 6 of 9: Audio Out 2
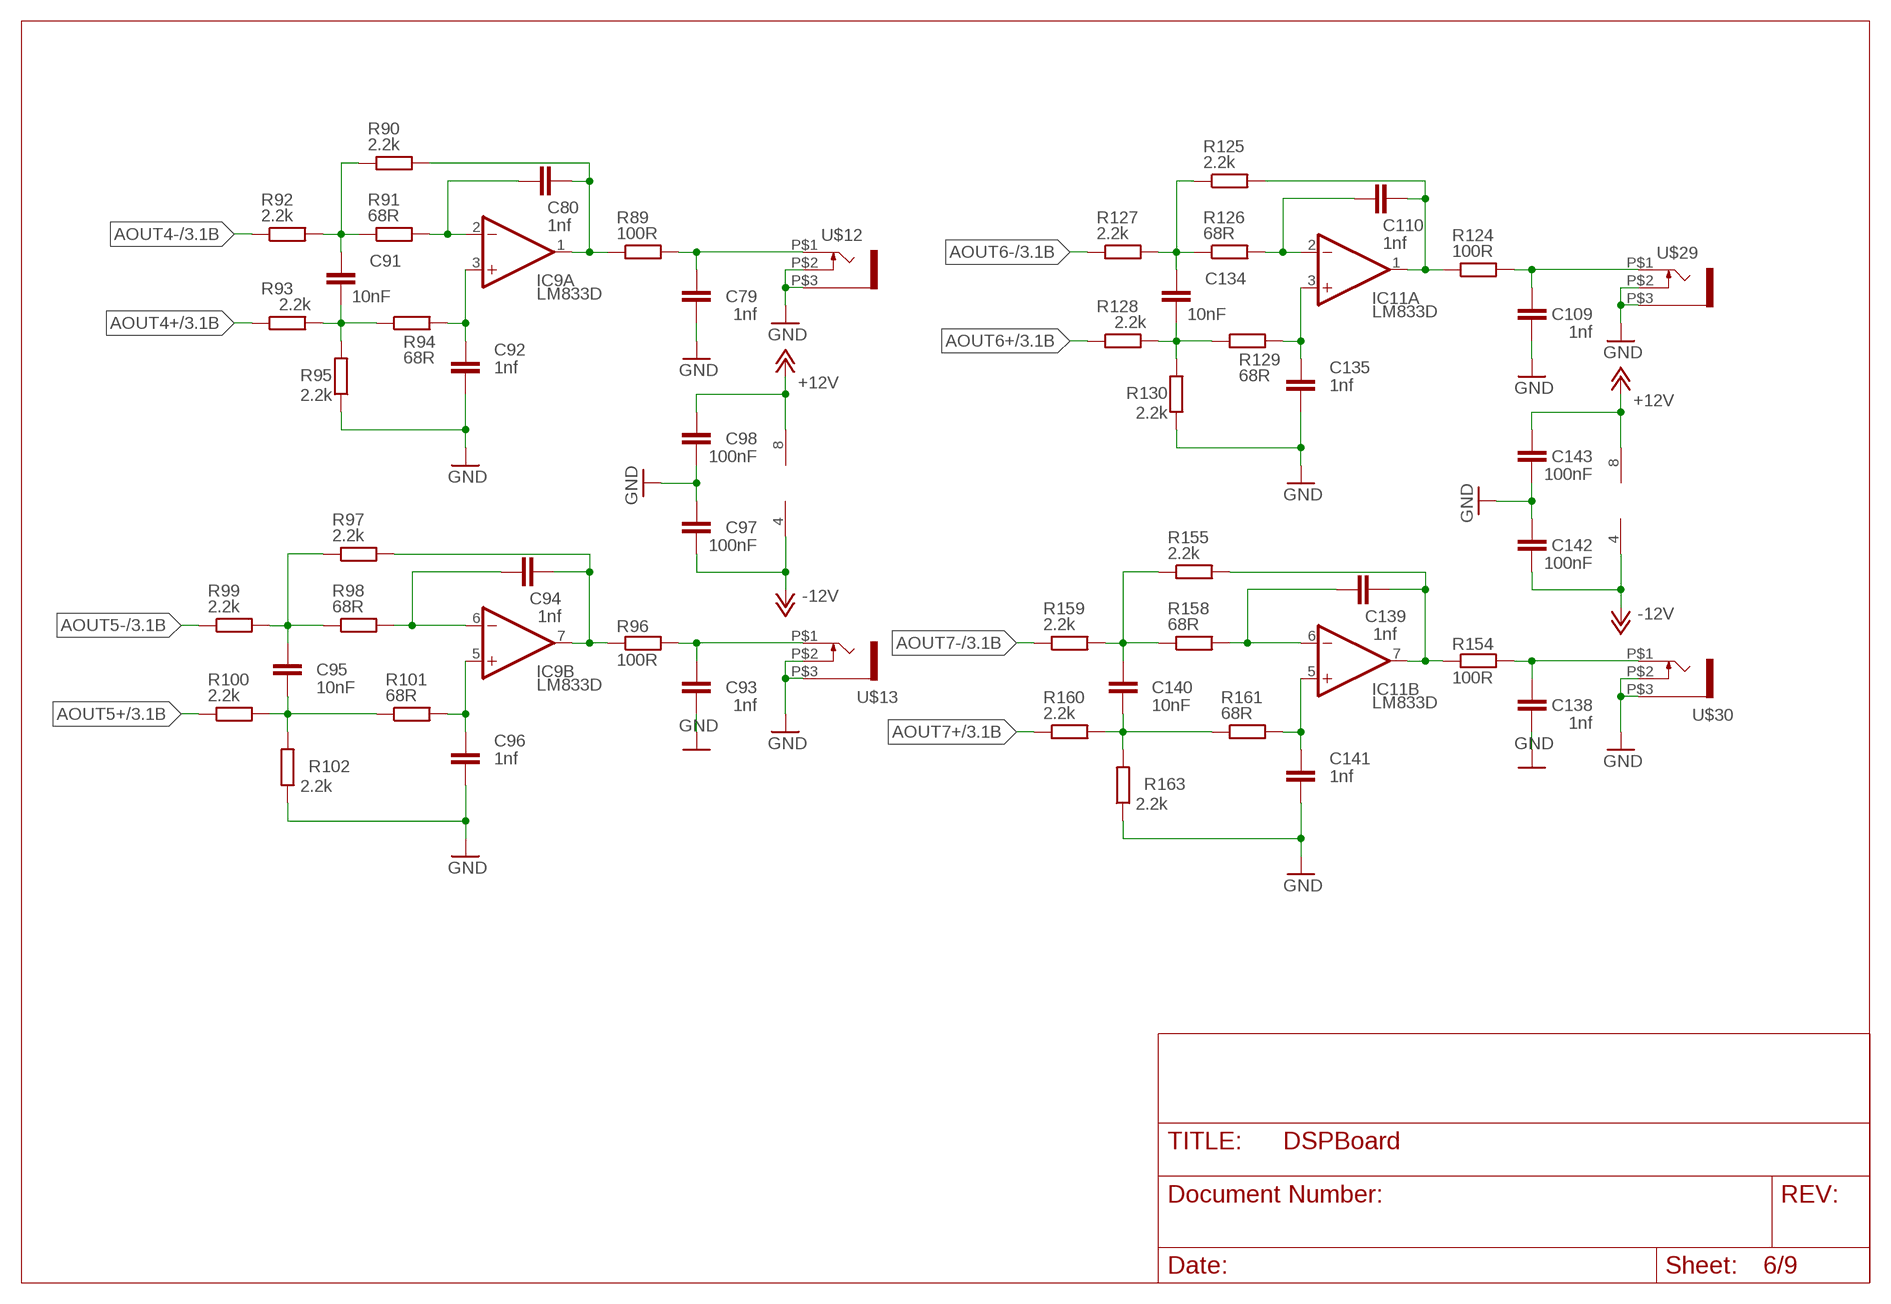
[diagram p5: schematic, sheet 6]

### Parts
C79  1nf  C-EUC0603  [C0603]
C80  1nf  C-EUC0603  [C0603]
C91  10nF  C-EUC0603  [C0603]
C92  1nf  C-EUC0603  [C0603]
C93  1nf  C-EUC0603  [C0603]
C94  1nf  C-EUC0603  [C0603]
C95  10nF  C-EUC0603  [C0603]
C96  1nf  C-EUC0603  [C0603]
C97  100nF  C-EUC0603  [C0603]
C98  100nF  C-EUC0603  [C0603]
C109  1nf  C-EUC0603  [C0603]
C110  1nf  C-EUC0603  [C0603]
C134  10nF  C-EUC0603  [C0603]
C135  1nf  C-EUC0603  [C0603]
C138  1nf  C-EUC0603  [C0603]
C139  1nf  C-EUC0603  [C0603]
C140  10nF  C-EUC0603  [C0603]
C141  1nf  C-EUC0603  [C0603]
C142  100nF  C-EUC0603  [C0603]
C143  100nF  C-EUC0603  [C0603]
IC9  LM833D  [SO08]
IC11  LM833D  [SO08]
R89  100R  R-EU_R0603  [R0603]
R90  2.2k  R-EU_R0603  [R0603]
R91  68R  R-EU_R0603  [R0603]
R92  2.2k  R-EU_R0603  [R0603]
R93  2.2k  R-EU_R0603  [R0603]
R94  68R  R-EU_R0603  [R0603]
R95  2.2k  R-EU_R0603  [R0603]
R96  100R  R-EU_R0603  [R0603]
R97  2.2k  R-EU_R0603  [R0603]
R98  68R  R-EU_R0603  [R0603]
R99  2.2k  R-EU_R0603  [R0603]
R100  2.2k  R-EU_R0603  [R0603]
R101  68R  R-EU_R0603  [R0603]
R102  2.2k  R-EU_R0603  [R0603]
R124  100R  R-EU_R0603  [R0603]
R125  2.2k  R-EU_R0603  [R0603]
R126  68R  R-EU_R0603  [R0603]
R127  2.2k  R-EU_R0603  [R0603]
R128  2.2k  R-EU_R0603  [R0603]
R129  68R  R-EU_R0603  [R0603]
R130  2.2k  R-EU_R0603  [R0603]
R154  100R  R-EU_R0603  [R0603]
R155  2.2k  R-EU_R0603  [R0603]
R158  68R  R-EU_R0603  [R0603]
R159  2.2k  R-EU_R0603  [R0603]
R160  2.2k  R-EU_R0603  [R0603]
R161  68R  R-EU_R0603  [R0603]
R163  2.2k  R-EU_R0603  [R0603]
U$12  WQP-PJ301M-12_JACK  [WQP-PJ301M-12_JACK]
U$13  WQP-PJ301M-12_JACK  [WQP-PJ301M-12_JACK]
U$29  WQP-PJ301M-12_JACK  [WQP-PJ301M-12_JACK]
U$30  WQP-PJ301M-12_JACK  [WQP-PJ301M-12_JACK]

### Nets
+12V: C98.2 C143.2 IC9.8(P:V+) IC11.8(P:V+) ; also sheet 1,4,5,7
-12V: C97.1 C142.1 IC9.4(P:V-) IC11.4(P:V-) ; also sheet 1,4,5,7
AOUT4+: R93.1 ; also sheet 3
AOUT4-: R92.1 ; also sheet 3
AOUT5+: R100.1 ; also sheet 3
AOUT5-: R99.1 ; also sheet 3
AOUT6+: R128.1 ; also sheet 3
AOUT6-: R127.1 ; also sheet 3
AOUT7+: R160.1 ; also sheet 3
AOUT7-: R159.1 ; also sheet 3
GND: C79.1 C92.2 C93.1 C96.2 C97.2 C98.1 C109.1 C135.2 C138.1 C141.2 C142.2 C143.1 R95.1 R102.1 R130.1 R163.1 U$12.P$2 U$12.P$3 U$13.P$2 U$13.P$3 U$29.P$2 U$29.P$3 U$30.P$2 U$30.P$3 ; also sheet 1,2,3,4,5,7,8,9
N$65: C94.2 IC9.6(B:-IN) R98.2
N$66: C95.1 R97.1 R98.1 R99.2
N$67: C95.2 R100.2 R101.1 R102.2
N$68: C94.1 IC9.7(B:OUT) R96.1 R97.2
N$84: C96.1 IC9.5(B:+IN) R101.2
N$85: C93.2 R96.2 U$13.P$1
N$86: C79.2 R89.2 U$12.P$1
N$87: C80.1 IC9.1(A:OUT) R89.1 R90.2
N$88: C80.2 IC9.2(A:-IN) R91.2
N$89: C91.1 R90.1 R91.1 R92.2
N$90: C91.2 R93.2 R94.1 R95.2
N$91: C92.1 IC9.3(A:+IN) R94.2
N$104: C139.2 IC11.6(B:-IN) R158.2
N$105: C140.1 R155.1 R158.1 R159.2
N$106: C140.2 R160.2 R161.1 R163.2
N$107: C139.1 IC11.7(B:OUT) R154.1 R155.2
N$123: C141.1 IC11.5(B:+IN) R161.2
N$126: C138.2 R154.2 U$30.P$1
N$130: C109.2 R124.2 U$29.P$1
N$132: C110.1 IC11.1(A:OUT) R124.1 R125.2
N$134: C110.2 IC11.2(A:-IN) R126.2
N$136: C134.1 R125.1 R126.1 R127.2
N$137: C134.2 R128.2 R129.1 R130.2
N$139: C135.1 IC11.3(A:+IN) R129.2

## Sheet 7 of 9: TactileControls
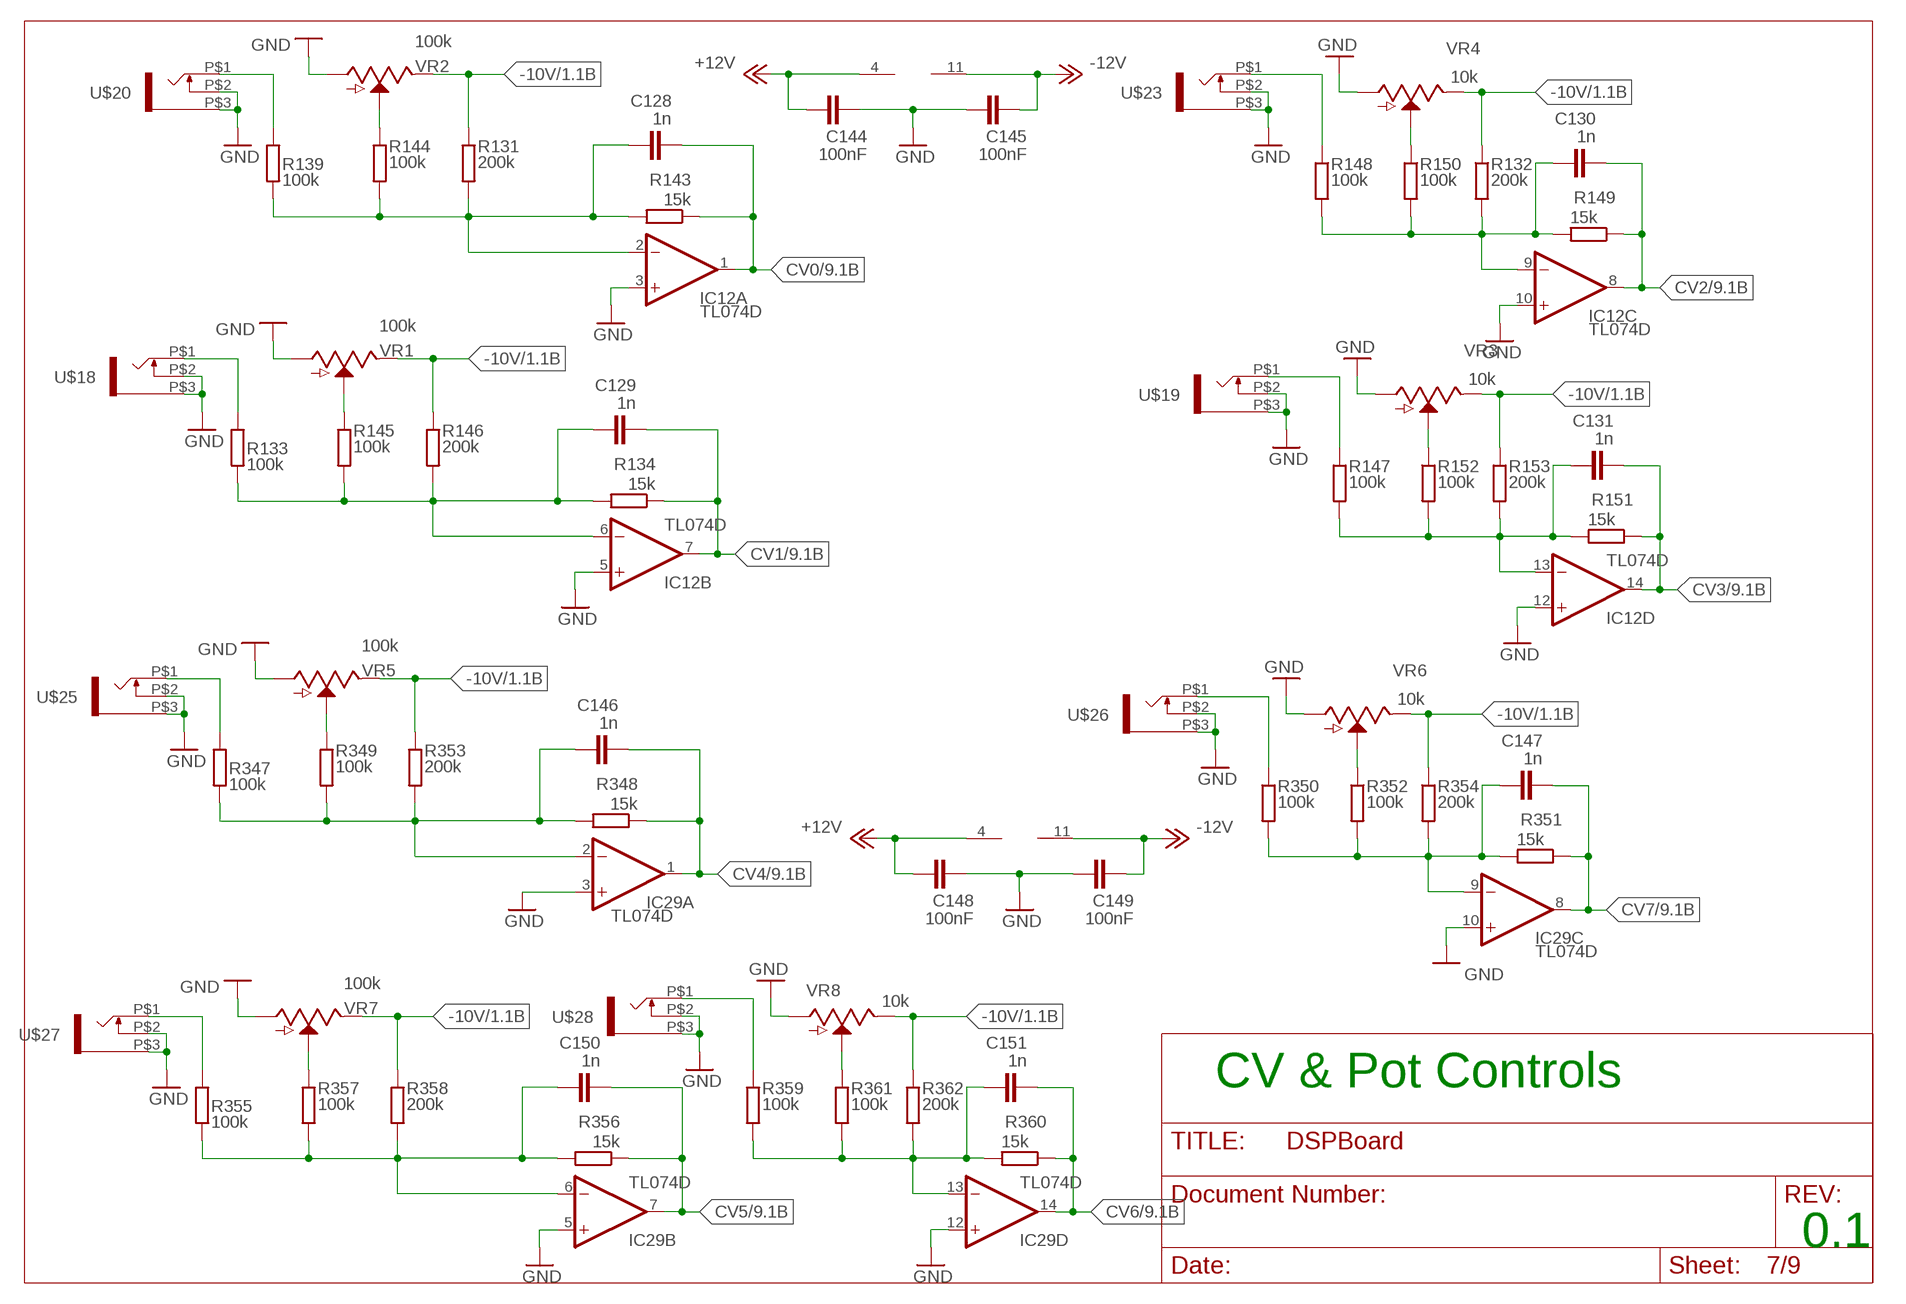
[diagram p6: schematic, sheet 7]

### Parts
C128  1n  C-EUC0603  [C0603]
C129  1n  C-EUC0603  [C0603]
C130  1n  C-EUC0603  [C0603]
C131  1n  C-EUC0603  [C0603]
C144  100nF  C-EUC0603  [C0603]
C145  100nF  C-EUC0603  [C0603]
C146  1n  C-EUC0603  [C0603]
C147  1n  C-EUC0603  [C0603]
C148  100nF  C-EUC0603  [C0603]
C149  100nF  C-EUC0603  [C0603]
C150  1n  C-EUC0603  [C0603]
C151  1n  C-EUC0603  [C0603]
IC12  TL074D  [SO14]
IC29  TL074D  [SO14]
R131  200k  R-EU_R0603  [R0603]
R132  200k  R-EU_R0603  [R0603]
R133  100k  R-EU_R0603  [R0603]
R134  15k  R-EU_R0603  [R0603]
R139  100k  R-EU_R0603  [R0603]
R143  15k  R-EU_R0603  [R0603]
R144  100k  R-EU_R0603  [R0603]
R145  100k  R-EU_R0603  [R0603]
R146  200k  R-EU_R0603  [R0603]
R147  100k  R-EU_R0603  [R0603]
R148  100k  R-EU_R0603  [R0603]
R149  15k  R-EU_R0603  [R0603]
R150  100k  R-EU_R0603  [R0603]
R151  15k  R-EU_R0603  [R0603]
R152  100k  R-EU_R0603  [R0603]
R153  200k  R-EU_R0603  [R0603]
R347  100k  R-EU_R0603  [R0603]
R348  15k  R-EU_R0603  [R0603]
R349  100k  R-EU_R0603  [R0603]
R350  100k  R-EU_R0603  [R0603]
R351  15k  R-EU_R0603  [R0603]
R352  100k  R-EU_R0603  [R0603]
R353  200k  R-EU_R0603  [R0603]
R354  200k  R-EU_R0603  [R0603]
R355  100k  R-EU_R0603  [R0603]
R356  15k  R-EU_R0603  [R0603]
R357  100k  R-EU_R0603  [R0603]
R358  200k  R-EU_R0603  [R0603]
R359  100k  R-EU_R0603  [R0603]
R360  15k  R-EU_R0603  [R0603]
R361  100k  R-EU_R0603  [R0603]
R362  200k  R-EU_R0603  [R0603]
U$18  WQP-PJ301M-12_JACK  [WQP-PJ301M-12_JACK]
U$19  WQP-PJ301M-12_JACK  [WQP-PJ301M-12_JACK]
U$20  WQP-PJ301M-12_JACK  [WQP-PJ301M-12_JACK]
U$23  WQP-PJ301M-12_JACK  [WQP-PJ301M-12_JACK]
U$25  WQP-PJ301M-12_JACK  [WQP-PJ301M-12_JACK]
U$26  WQP-PJ301M-12_JACK  [WQP-PJ301M-12_JACK]
U$27  WQP-PJ301M-12_JACK  [WQP-PJ301M-12_JACK]
U$28  WQP-PJ301M-12_JACK  [WQP-PJ301M-12_JACK]
VR1  100k  POTENTIOMETER-PTH-9MM-1/20W-20%-KIT  [POT-PTH-ALPS-KIT]
VR2  100k  POTENTIOMETER-PTH-9MM-1/20W-20%-KIT  [POT-PTH-ALPS-KIT]
VR3  10k  POTENTIOMETER-PTH-9MM-1/20W-20%-KIT  [POT-PTH-ALPS-KIT]
VR4  10k  POTENTIOMETER-PTH-9MM-1/20W-20%-KIT  [POT-PTH-ALPS-KIT]
VR5  100k  POTENTIOMETER-PTH-9MM-1/20W-20%-KIT  [POT-PTH-ALPS-KIT]
VR6  10k  POTENTIOMETER-PTH-9MM-1/20W-20%-KIT  [POT-PTH-ALPS-KIT]
VR7  100k  POTENTIOMETER-PTH-9MM-1/20W-20%-KIT  [POT-PTH-ALPS-KIT]
VR8  10k  POTENTIOMETER-PTH-9MM-1/20W-20%-KIT  [POT-PTH-ALPS-KIT]

### Nets
+12V: C144.1 C148.1 IC12.4(P:V+) IC29.4(P:V+) ; also sheet 1,4,5,6
-10V: R131.1 R132.1 R146.1 R153.1 R353.1 R354.1 R358.1 R362.1 VR1.P$1(E) VR2.P$1(E) VR3.P$1(E) VR4.P$1(E) VR5.P$1(E) VR6.P$1(E) VR7.P$1(E) VR8.P$1(E) ; also sheet 1
-12V: C145.2 C149.2 IC12.11(P:V-) IC29.11(P:V-) ; also sheet 1,4,5,6
CV0: C128.2 IC12.1(A:OUT) R143.1 ; also sheet 9
CV1: C129.2 IC12.7(B:OUT) R134.1 ; also sheet 9
CV2: C130.2 IC12.8(C:OUT) R149.1 ; also sheet 9
CV3: C131.2 IC12.14(D:OUT) R151.1 ; also sheet 9
CV4: C146.2 IC29.1(A:OUT) R348.1 ; also sheet 9
CV5: C150.2 IC29.7(B:OUT) R356.1 ; also sheet 9
CV6: C151.2 IC29.14(D:OUT) R360.1 ; also sheet 9
CV7: C147.2 IC29.8(C:OUT) R351.1 ; also sheet 9
GND: C144.2 C145.1 C148.2 C149.1 IC12.3(A:+IN) IC12.5(B:+IN) IC12.10(C:+IN) IC12.12(D:+IN) IC29.3(A:+IN) IC29.5(B:+IN) IC29.10(C:+IN) IC29.12(D:+IN) U$18.P$2 U$18.P$3 U$19.P$2 U$19.P$3 U$20.P$2 U$20.P$3 U$23.P$2 U$23.P$3 U$25.P$2 U$25.P$3 U$26.P$2 U$26.P$3 U$27.P$2 U$27.P$3 U$28.P$2 U$28.P$3 VR1.P$3(A) VR2.P$3(A) VR3.P$3(A) VR4.P$3(A) VR5.P$3(A) VR6.P$3(A) VR7.P$3(A) VR8.P$3(A) ; also sheet 1,2,3,4,5,6,8,9
N$108: R144.1 VR2.P$2(S)
N$109: R139.1 U$20.P$1
N$110: R148.1 U$23.P$1
N$111: C128.1 IC12.2(A:-IN) R131.2 R139.2 R143.2 R144.2
N$112: R150.1 VR4.P$2(S)
N$113: C130.1 IC12.9(C:-IN) R132.2 R148.2 R149.2 R150.2
N$114: R145.1 VR1.P$2(S)
N$115: R133.1 U$18.P$1
N$116: C129.1 IC12.6(B:-IN) R133.2 R134.2 R145.2 R146.2
N$118: R147.1 U$19.P$1
N$121: R152.1 VR3.P$2(S)
N$122: C131.1 IC12.13(D:-IN) R147.2 R151.2 R152.2 R153.2
N$524: R349.1 VR5.P$2(S)
N$533: R347.1 U$25.P$1
N$534: C146.1 IC29.2(A:-IN) R347.2 R348.2 R349.2 R353.2
N$535: R350.1 U$26.P$1
N$536: R352.1 VR6.P$2(S)
N$537: C147.1 IC29.9(C:-IN) R350.2 R351.2 R352.2 R354.2
N$538: R357.1 VR7.P$2(S)
N$539: R355.1 U$27.P$1
N$540: C150.1 IC29.6(B:-IN) R355.2 R356.2 R357.2 R358.2
N$541: R359.1 U$28.P$1
N$542: R361.1 VR8.P$2(S)
N$543: C151.1 IC29.13(D:-IN) R359.2 R360.2 R361.2 R362.2

### Notes on the sheet
- CV & Pot Controls
- 0.1

## Sheet 8 of 9: uC
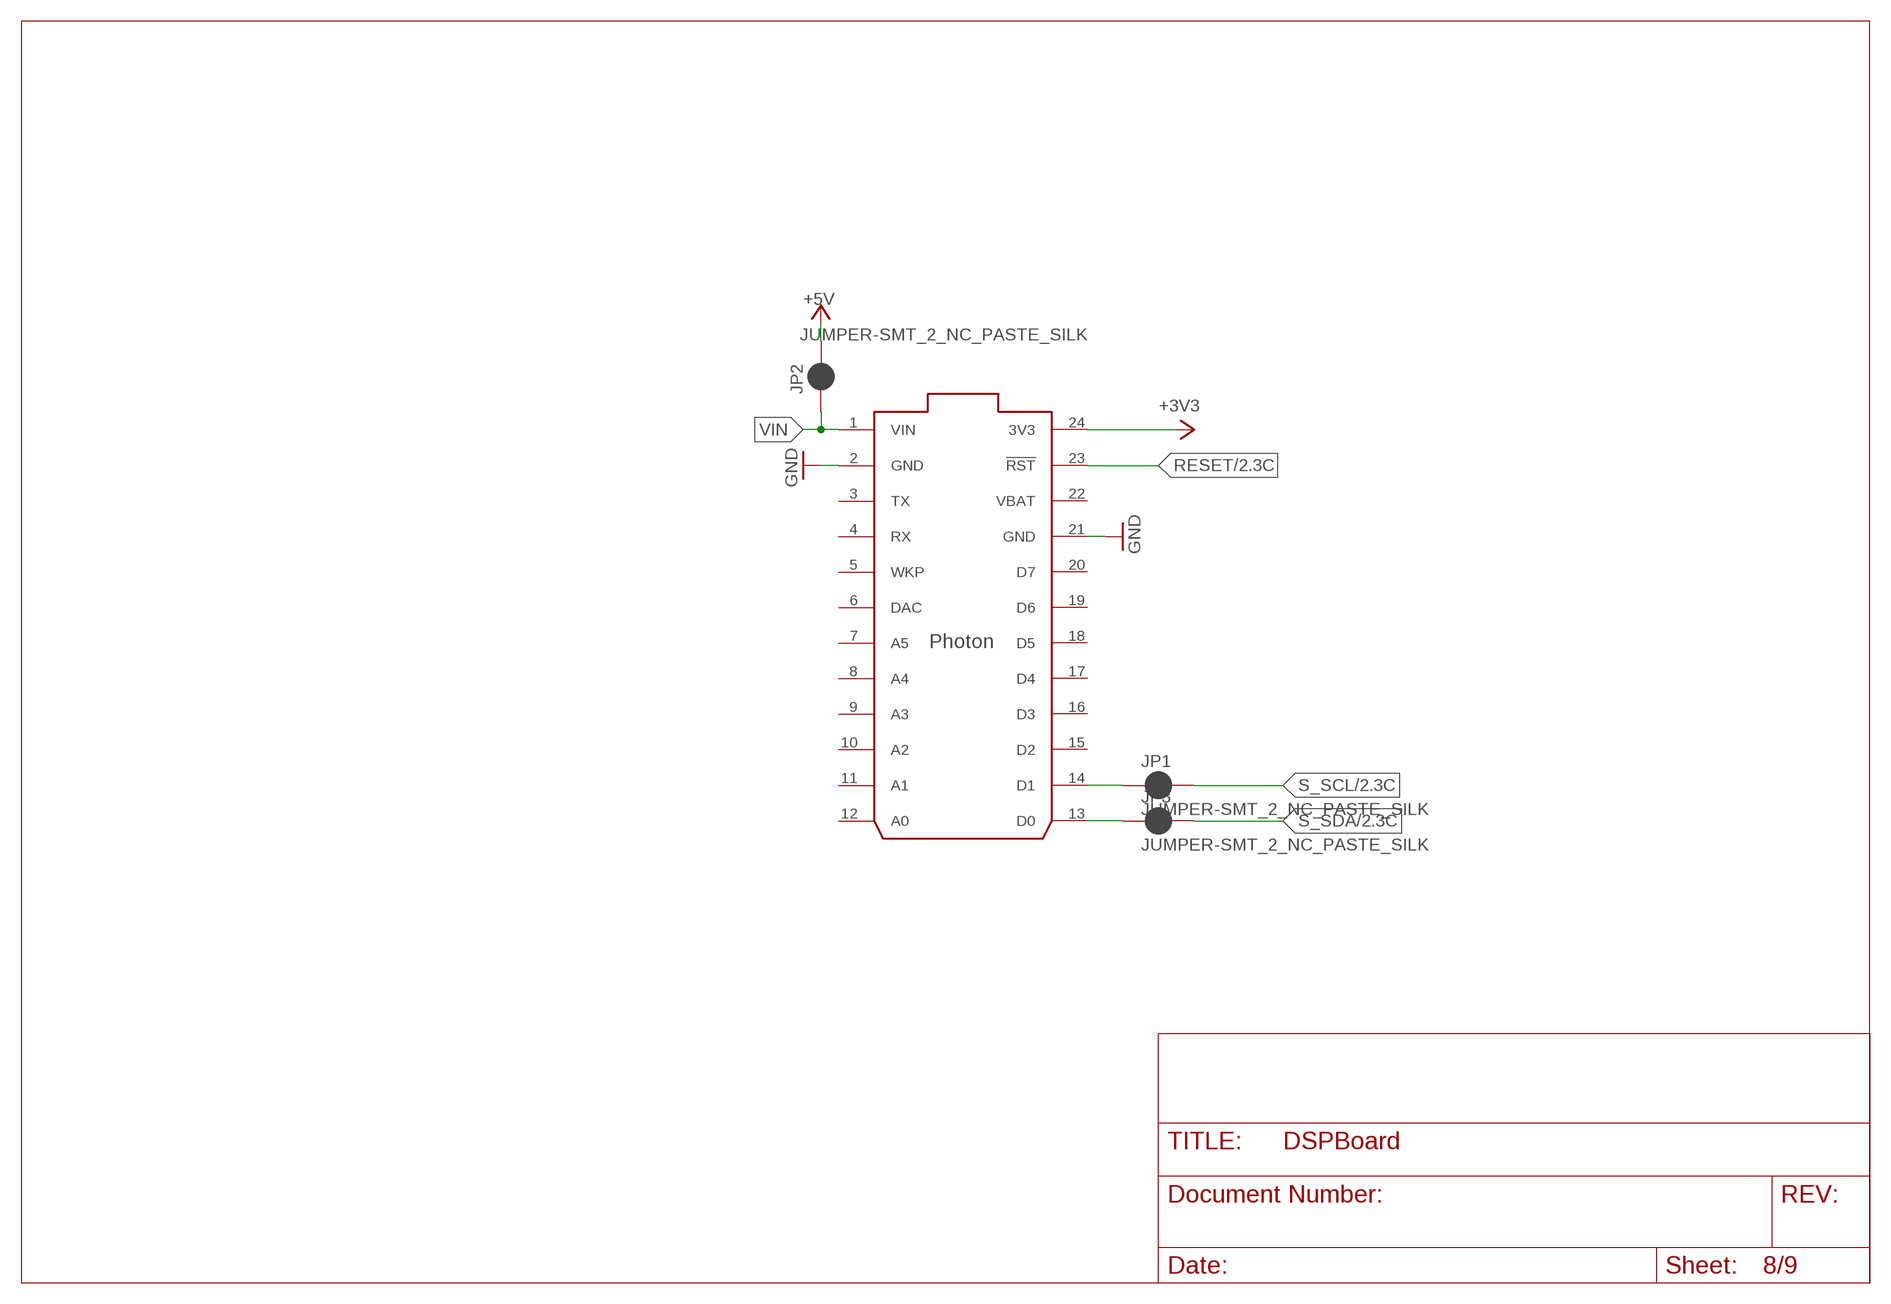
[diagram p7: schematic, sheet 8]

### Parts
JP1  JUMPER-SMT_2_NC_PASTE_SILK  [SMT-JUMPER_2_NC_PASTE_SILK]
JP2  JUMPER-SMT_2_NC_PASTE_SILK  [SMT-JUMPER_2_NC_PASTE_SILK]
JP3  JUMPER-SMT_2_NC_PASTE_SILK  [SMT-JUMPER_2_NC_PASTE_SILK]
U$5  PHOTON_WITH_HEADERS  [PHOTON]

### Nets
+3V3: U$5.24(3V3) ; also sheet 1,2,3,9
+5V: JP2.2 ; also sheet 1,9
GND: U$5.2(GND) U$5.21(GND) ; also sheet 1,2,3,4,5,6,7,9
N$96: JP1.1 U$5.14(D1)
N$97: JP3.1 U$5.13(D0)
RESET: U$5.23(!RST) ; also sheet 2,3
S_SCL: JP1.2 ; also sheet 2
S_SDA: JP3.2 ; also sheet 2
VIN: JP2.1 U$5.1(VIN)
Unconnected: U$5.3(TX) U$5.4(RX) U$5.5(WKP) U$5.6(DAC) U$5.7(A5) U$5.8(A4) U$5.9(A3) U$5.10(A2) U$5.11(A1) U$5.12(A0) U$5.15(D2) U$5.16(D3) U$5.17(D4) U$5.18(D5) U$5.19(D6) U$5.20(D7)

## Sheet 9 of 9: multiplexers
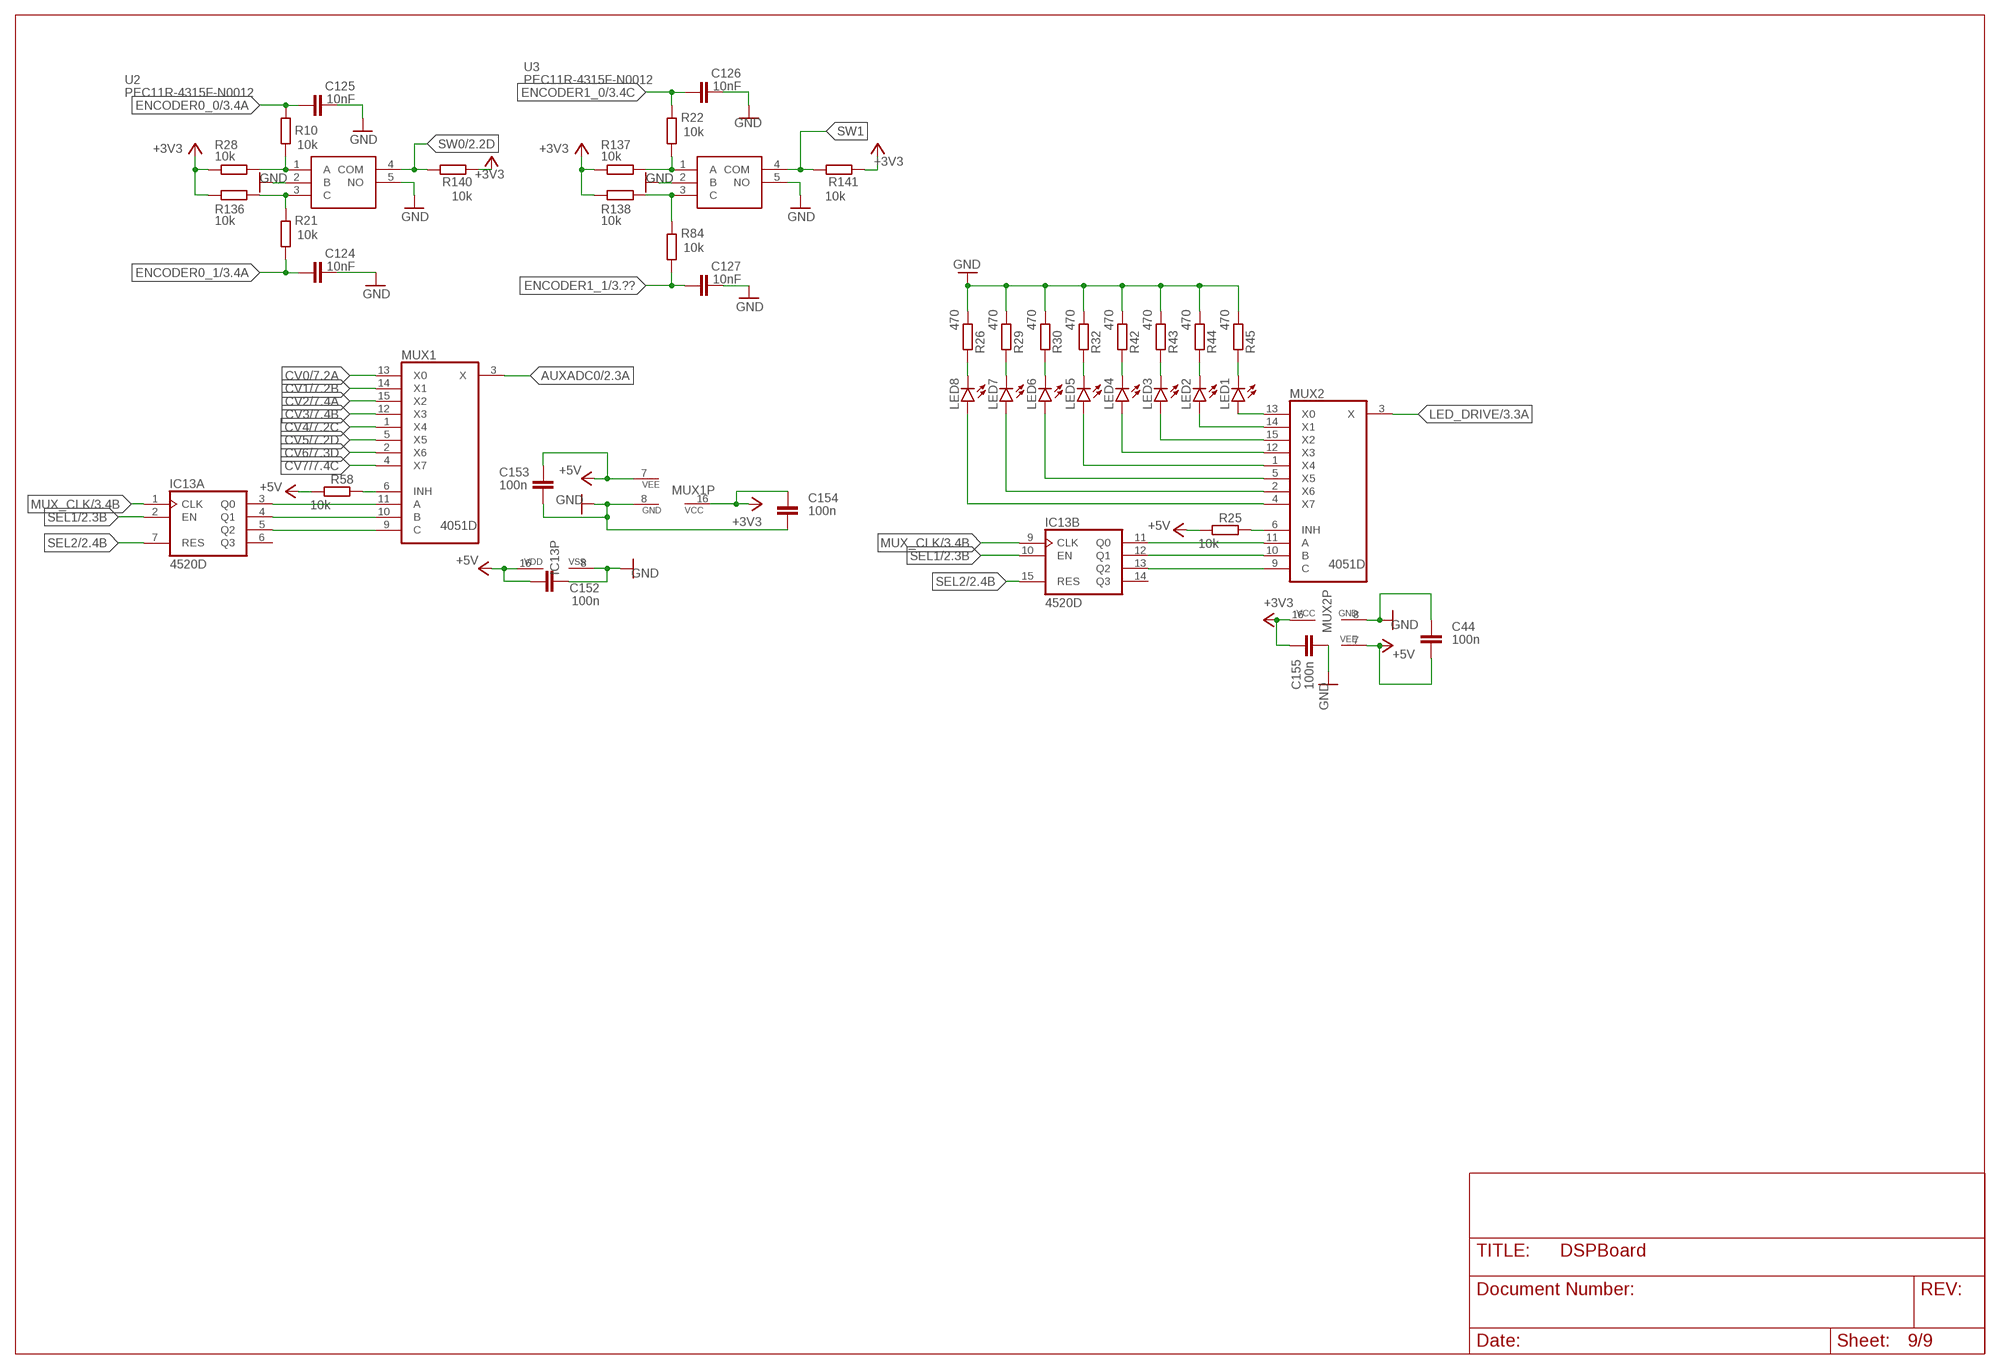
[diagram p8: schematic, sheet 9]

### Parts
C44  100n  C-EUC0603  [C0603]
C124  10nF  C-EUC0603  [C0603]
C125  10nF  C-EUC0603  [C0603]
C126  10nF  C-EUC0603  [C0603]
C127  10nF  C-EUC0603  [C0603]
C152  100n  C-EUC0603  [C0603]
C153  100n  C-EUC0603  [C0603]
C154  100n  C-EUC0603  [C0603]
C155  100n  C-EUC0603  [C0603]
IC13  4520D  [SO16]
LED1  LEDCHIPLED_0805  [CHIPLED_0805]
LED2  LEDCHIPLED_0805  [CHIPLED_0805]
LED3  LEDCHIPLED_0805  [CHIPLED_0805]
LED4  LEDCHIPLED_0805  [CHIPLED_0805]
LED5  LEDCHIPLED_0805  [CHIPLED_0805]
LED6  LEDCHIPLED_0805  [CHIPLED_0805]
LED7  LEDCHIPLED_0805  [CHIPLED_0805]
LED8  LEDCHIPLED_0805  [CHIPLED_0805]
MUX1  4051D  [SO16]
MUX2  4051D  [SO16]
R10  10k  R-EU_R0603  [R0603]
R21  10k  R-EU_R0603  [R0603]
R22  10k  R-EU_R0603  [R0603]
R25  10k  R-EU_R0603  [R0603]
R26  470  R-EU_R0603  [R0603]
R28  10k  R-EU_R0603  [R0603]
R29  470  R-EU_R0603  [R0603]
R30  470  R-EU_R0603  [R0603]
R32  470  R-EU_R0603  [R0603]
R42  470  R-EU_R0603  [R0603]
R43  470  R-EU_R0603  [R0603]
R44  470  R-EU_R0603  [R0603]
R45  470  R-EU_R0603  [R0603]
R58  10k  R-EU_R0603  [R0603]
R84  10k  R-EU_R0603  [R0603]
R136  10k  R-EU_R0603  [R0603]
R137  10k  R-EU_R0603  [R0603]
R138  10k  R-EU_R0603  [R0603]
R140  10k  R-EU_R0603  [R0603]
R141  10k  R-EU_R0603  [R0603]
U2  PEC11R-4315F-N0012  [PEC12R-4XXXF-SXXXX_1]
U3  PEC11R-4315F-N0012  [PEC12R-4XXXF-SXXXX_1]

### Nets
+3V3: C153.2 C154.2 C155.2 MUX1.7(VEE) MUX1.16(VCC) MUX2.16(VCC) R25.1 R28.1 R58.1 R136.1 R137.1 R138.1 R140.1 R141.1 ; supply symbol labelled +5V ; also sheet 1,2,3,8
+5V: C44.1 C152.1 IC13.16(P:VDD) MUX2.7(VEE) ; also sheet 1,8
AUXADC0: MUX1.3(X) ; also sheet 2
CV0: MUX1.13(X0) ; also sheet 7
CV1: MUX1.14(X1) ; also sheet 7
CV2: MUX1.15(X2) ; also sheet 7
CV3: MUX1.12(X3) ; also sheet 7
CV4: MUX1.1(X4) ; also sheet 7
CV5: MUX1.5(X5) ; also sheet 7
CV6: MUX1.2(X6) ; also sheet 7
CV7: MUX1.4(X7) ; also sheet 7
ENCODER0_0: C125.1 R10.2 ; also sheet 3
ENCODER0_1: C124.1 R21.1 ; also sheet 3
ENCODER1_0: C126.1 R22.2 ; also sheet 3
ENCODER1_1: C127.1 R84.1 ; also sheet 3
GND: C44.2 C124.2 C125.2 C126.2 C127.2 C152.2 C153.1 C154.1 C155.1 IC13.8(P:VSS) MUX1.8(GND) MUX2.8(GND) R26.1 R29.1 R30.1 R32.1 R42.1 R43.1 R44.1 R45.1 U2.2(B) U2.5(NO) U3.2(B) U3.5(NO) ; also sheet 1,2,3,4,5,6,7,8
LED_DRIVE: MUX2.3(X) ; also sheet 3
MUX1_A: IC13.3(A:Q0) MUX1.11(A)
MUX1_B: IC13.4(A:Q1) MUX1.10(B)
MUX1_C: IC13.5(A:Q2) MUX1.9(C)
MUX1_ENABLE: MUX1.6(INH) R58.2
MUX1_ENABLE1: MUX2.6(INH) R25.2
MUX2_A_A: IC13.11(B:Q0) MUX2.11(A)
MUX2_A_B: IC13.12(B:Q1) MUX2.10(B)
MUX2_A_C: IC13.13(B:Q2) MUX2.9(C)
MUX_CLK: IC13.1(A:CLK) IC13.9(B:CLK) ; also sheet 3
N$17: LED1.A MUX2.13(X0)
N$22: LED2.A MUX2.14(X1)
N$26: LED3.A MUX2.15(X2)
N$30: LED4.A MUX2.12(X3)
N$33: LED5.A MUX2.1(X4)
N$34: LED6.A MUX2.5(X5)
N$36: LED7.A MUX2.2(X6)
N$38: LED8.A MUX2.4(X7)
N$39: LED1.C R45.2
N$40: LED2.C R44.2
N$41: LED3.C R43.2
N$52: LED4.C R42.2
N$69: R10.1 R28.2 U2.1(A)
N$92: LED5.C R32.2
N$93: LED6.C R30.2
N$94: LED7.C R29.2
N$95: LED8.C R26.2
N$125: R22.1 R137.2 U3.1(A)
N$131: R84.2 R138.2 U3.3(C)
N$133: R21.2 R136.2 U2.3(C)
SEL1: IC13.2(A:EN) IC13.10(B:EN) ; also sheet 2
SEL2: IC13.7(A:RES) IC13.15(B:RES) ; also sheet 2
SW0: R140.2 U2.4(COM) ; also sheet 2,3
SW1: R141.2 U3.4(COM)
Unconnected: IC13.6(A:Q3) IC13.14(B:Q3)

## Power pins joined to a net without a drawn wire
VBAT: U$5.22(VBAT)

## Library data of the parts
C1-C16 C18-C24 C26-C34 C36-C38 C40-C48 C57 C58 C60-C62 C64-C98 C109-C118 C120 C122-C131 C133-C135 C137-C162 C164-C166 C177 C178 C180-C182 C184-C186 = rcl:C-EU: CAPACITOR, European symbol; SPICEPREFIX: C
C35 C39 C59 C63 C119 C121 C132 C136 C163 C179 C183 = rcl:CPOL-EU: POLARIZED CAPACITOR, European symbol; SPICEPREFIX: C
D1 D2 D5 D6 D9 D10 D13 D14 = SamacSys_Parts:BAV99,215: Diodes - General Purpose, Power, Switching SW DBL 75V 215MA HS Source: Datasheet <https://componentsearchengine.com/Datasheets/1/BAV99,215.pdf>; DESCRIPTION: Diodes - General Purpose, Power, Switching SW DBL 75V 215MA HS; HEIGHT: 1.1mm; MANUFACTURER_NAME: Nexperia; MANUFACTURER_PART_NUMBER: BAV99,215; MOUSER_PART_NUMBER: 771-BAV99-T/R
IC1 = AD1939WBSTZ:AD1939WBSTZ: Audio Codec 4ADC / 8DAC 24-Bit LQFP64 Analog Devices, Audio Codec Stereo Audio 12-channel 24bit- 192kHz Serial 64-Pin LQFP Source: Datasheet <https://componentsearchengine.com/Datasheets/1/AD1939WBSTZ.pdf>; DESCRIPTION: Audio Codec 4ADC / 8DAC 24-Bit LQFP64 Analog Devices, Audio Codec Stereo Audio 12-channel 24bit- 192kHz Serial 64-Pin LQFP; HEIGHT: 1.6mm; MANUFACTURER_NAME: Analog Devices; MANUFACTURER_PART_NUMBER: AD1939WBSTZ; MOUSER_PART_NUMBER: 584-AD1939WBSTZ
IC2 = audioic:24AA1025
IC3 = texas:LM4041: PRECISION MICROPOWER SHUNT VOLTAGE REFERENCE Source: http://focus.ti.com/lit/ds/slcs146e/slcs146e.pdf; MPN: LM4041B12IDBZR; OC_FARNELL: 1575212; OC_NEWARK: 58K5882; SPICEPREFIX: I
IC4 IC6-IC9 IC11 IC14 IC16 = linear:LM833: OP AMP
IC12 IC29 = linear:TL074: OP AMP
IC13 = 45xx:4520: Dual binary up COUNTER
J1-J4 = SparkFun-Connectors:CONN_01: Single connection point. Often used as Generic Header-pin footprint for 0.1 inch spaced/style header connections On any of the 0.1 inch spaced packages, you can populate with these: Break Away Headers - Straight <https://www.sparkfun.com/products/116> (PRT-00116) Break Away Male Headers - Right Angle <https://www.sparkfun.com/products/553> (PRT-00553) Female Headers <https://www.sparkfun.com/products/115> (PRT-00115) Break Away Headers - Machine Pin <https://www.sparkfun.com/products/117> (PRT-00117) Break Away Female Headers - Swiss Machine Pin <https://www.sparkfun.com/products/743> (PRT-00743) This device is also useful as a general connection point to wire up your design to another part of your project. Our various solder wires solder well into these plated through hole pads. Hook-Up Wire - Assortment (Stranded, 22 AWG) <https://www.sparkfun.com/products/11375> (PRT-11375) Hook-Up Wire - Assortment (Solid Core, 22 AWG) <https://www.sparkfun.com/products/11367> (PRT-11367) View the entire wire category on our website here <https://www.sparkfun.com/categories/141> Special notes: SMTSO-256-ET is a "flush mount" nut for a 4-40 screw. We mostly use this on specialty testbeds; it is a nice way to connect hardware to your PCB at an adjustable hieght. Also note, the SNAP packages are for using a snappable style connector. We sell a baggie of snaps and they are also used on two LilyPad designs: Snap Assortment - 30 pack (male and female) <https://www.sparkfun.com/products/11347> (DEV-11347) LilyPad Arduino SimpleSnap <https://www.sparkfun.com/products/10941> (DEV-10941) LilyPad SimpleSnap Protoboard <https://www.sparkfun.com/products/10940> (DEV-10940)
JP1-JP3 JP11-JP13 JP17-JP20 = SparkFun-Jumpers:JUMPER-SMT_2_NC_PASTE: Normally closed solder jumper This jumper has an aperture in the stencil to allow solder paste to bridge the split in the wire so it's normally closed (NC). Wick off the solder to open the connection. Reapply solder to reclose the connection.
LED1-LED8 = led:LED: LED OSRAM: - CHIPLED LG R971, LG N971, LY N971, LG Q971, LY Q971, LO R971, LY R971 LH N974, LH R974 LS Q976, LO Q976, LY Q976 LO Q996 - Hyper CHIPLED LW Q18S LB Q993, LB Q99A, LB R99A - SideLED LS A670, LO A670, LY A670, LG A670, LP A670 LB A673, LV A673, LT A673, LW A673 LH A674 LY A675 LS A676, LA A676, LO A676, LY A676, LW A676 LS A679, LY A679, LG A679 - Hyper Micro SIDELED® LS Y876, LA Y876, LO Y876, LY Y876 LT Y87S - SmartLED LW L88C, LW L88S LB L89C, LB L89S, LG L890 LS L89K, LO L89K, LY L89K LS L896, LA L896, LO L896, LY L896 - TOPLED LS T670, LO T670, LY T670, LG T670, LP T670 LSG T670, LSP T670, LSY T670, LOP T670, LYG T670 LG T671, LOG T671, LSG T671 LB T673, LV T673, LT T673, LW T673 LH T674 LS T676, LA T676, LO T676, LY T676, LB T676, LH T676, LSB T676, LW T676 LB T67C, LV T67C, LT T67C, LS T67K, LO T67K, LY T67K, LW E67C LS E67B, LA E67B, LO E67B, LY E67B, LB E67C, LV E67C, LT E67C LW T67C LS T679, LY T679, LG T679 LS T770, LO T770, LY T770, LG T770, LP T770 LB T773, LV T773, LT T773, LW T773 LH T774 LS E675, LA E675, LY E675, LS T675 LS T776, LA T776, LO T776, LY T776, LB T776 LHGB T686 LT T68C, LB T68C - Hyper Mini TOPLED® LB M676 - Mini TOPLED Santana® LG M470 LS M47K, LO M47K, LY M47K Source: http://www.osram.convergy.de LUXEON: - LUMILED® LXK2-PW12-R00, LXK2-PW12-S00, LXK2-PW14-U00, LXK2-PW14-V00 LXK2-PM12-R00, LXK2-PM12-S00, LXK2-PM14-U00 LXK2-PE12-Q00, LXK2-PE12-R00, LXK2-PE12-S00, LXK2-PE14-T00, LXK2-PE14-U00 LXK2-PB12-K00, LXK2-PB12-L00, LXK2-PB12-M00, LXK2-PB14-N00, LXK2-PB14-P00, LXK2-PB14-Q00 LXK2-PR12-L00, LXK2-PR12-M00, LXK2-PR14-Q00, LXK2-PR14-R00 LXK2-PD12-Q00, LXK2-PD12-R00, LXK2-PD12-S00 LXK2-PH12-R00, LXK2-PH12-S00 LXK2-PL12-P00, LXK2-PL12-Q00, LXK2-PL12-R00 Source: www.luxeon.com KINGBRIGHT: KA-3528ASYC Source: www.kingbright.com
MUX1 MUX2 = 40xx:4051: 8-channel ANALOG MULTIPLEXER
R1-R45 R50-R52 R54-R66 R68-R102 R107-R113 R124-R163 R177-R182 R186-R196 R208-R218 R347-R362 R364 R367-R370 = rcl:R-EU_: RESISTOR, European symbol; SPICEPREFIX: R
SPDIF = con-lstb:MA04-1: PIN HEADER; OC_FARNELL: unknown; OC_NEWARK: unknown
SV1 = con-lstb:MA05-2: PIN HEADER; OC_FARNELL: unknown; OC_NEWARK: unknown
U1 = LM11173p3:LM1117DTX-3.3/NOPB; MANUFACTURER: Texas Instruments; MANUFACTURER_NAME: Texas Instruments; MANUFACTURER_PART_NUMBER: LM1117DTX3.3NOPB; PARTNUMBER: LM1117DTX3.3NOPB; REFDES: RefDes; TYPE: TYPE; VALUE: Value
U2 U3 = SamacSys_Parts:PEC11R-4315F-N0012: Encoders ENCODER Source: Datasheet <https://componentsearchengine.com/Datasheets/1/PEC11R-4315F-N0012.pdf>; DESCRIPTION: Encoders ENCODER; HEIGHT: mm; MANUFACTURER_NAME: Bourns; MANUFACTURER_PART_NUMBER: PEC11R-4315F-N0012; MOUSER_PART_NUMBER: 652-PEC11R4315FN0012
U$1 = audioic:ADAU1452: Analog Devices ADAU1452 Sigma DSP Pin compatible with 146x series Sigma DSPs
U$2 = audioic:PBSS4032PZ
U$3 U$4 = texas3v3supplyLib:TPS561201
U$5 = Particle-Devices:PHOTON: Particle Photon Wi-Fi through-hole development board footprint Product datasheet: here <https://docs.particle.io/datasheets/photon-(wifi)/photon-datasheet/> Design files: here <https://github.com/particle-iot/photon> Github : Particle devices library <https://github.com/particle-iot/hardware-libraries/tree/master/Eagle>
U$6 U$8 U$9 U$12 U$13 U$16-U$23 U$25-U$31 = thonkiconn:WQP-PJ301M-12_JACK
U$10 = texas3v3supplyLib:CDPH4D19FNP-4R7MC; DCR: 0.038; IDC: 1.15; L: 4.7E6; MANUFACTURER_NAME: Sumida; MANUFACTURER_PART_NUMBER: CDPH4D19FNP4R7MC; VENDOR: Sumida
U$11 = texas5v5supplyLib:SDR1006-3R3ML; DCR: 0.024; IDC: 5.0; L: 3.3E6; MANUFACTURER_NAME: Bourns; MANUFACTURER_PART_NUMBER: SDR10063R3ML; VENDOR: Bourns
VR1 VR2 VR5 VR7 = SparkFun-Resistors:POTENTIOMETER: Potentiometer (Pot) Three-terminal potentiometers, with an adjustable wiper and two adjustable resistors. A pot can be used to create a configurable voltage divider, or as a variable resistor. Variants ALPS_POT and ALPS_POT_KIT - PTH, breadboard compatible, 9mm square pots Rotary Potentiometer - Linear (10k ohm) <https://www.sparkfun.com/products/9288> (COM-09288) The KIT variant exposes copper on only one side of the PTH pad, so the part can only be assembled on one side of the PCB. Useful for beginner soldering kits.; PROD_ID: RES-09177; SF_SKU: COM-09288; VALUE: 10k
VR3 VR4 VR6 VR8 = SparkFun-Resistors:POTENTIOMETER: Potentiometer (Pot) Three-terminal potentiometers, with an adjustable wiper and two adjustable resistors. A pot can be used to create a configurable voltage divider, or as a variable resistor. Variants ALPS_POT and ALPS_POT_KIT - PTH, breadboard compatible, 9mm square pots Rotary Potentiometer - Linear (10k ohm) <https://www.sparkfun.com/products/9288> (COM-09288) The KIT variant exposes copper on only one side of the PTH pad, so the part can only be assembled on one side of the PCB. Useful for beginner soldering kits.; PROD_ID: RES-09177; SF_SKU: COM-09288
X1 = con-3m:2510-: 3M (TM) Pak 100 4-Wall Header Source: 3M; MF: 3M; MPN: 2510-6002UB; OC_FARNELL: 9838244; OC_NEWARK: 46F4725
Y1 = SparkFun-Clocks:CRYSTAL-12.288MHZ: 12.288MHz Crystal Digikey Example <http://www.digikey.com/product-detail/en/abracon-llc/ABM3B-12.288MHZ-B2-T/535-9117-1-ND/675634> Frequency: 12.288MHz Frequency Stability: ±50ppm Frequency Tolerance: ±20ppm Load Capacitance: 18pF SparkFun Products: MP3 Trigger <https://www.sparkfun.com/products/13720> SparkFun MP3 Player Shield <https://www.sparkfun.com/products/12660>; PROD_ID: XTAL-09653